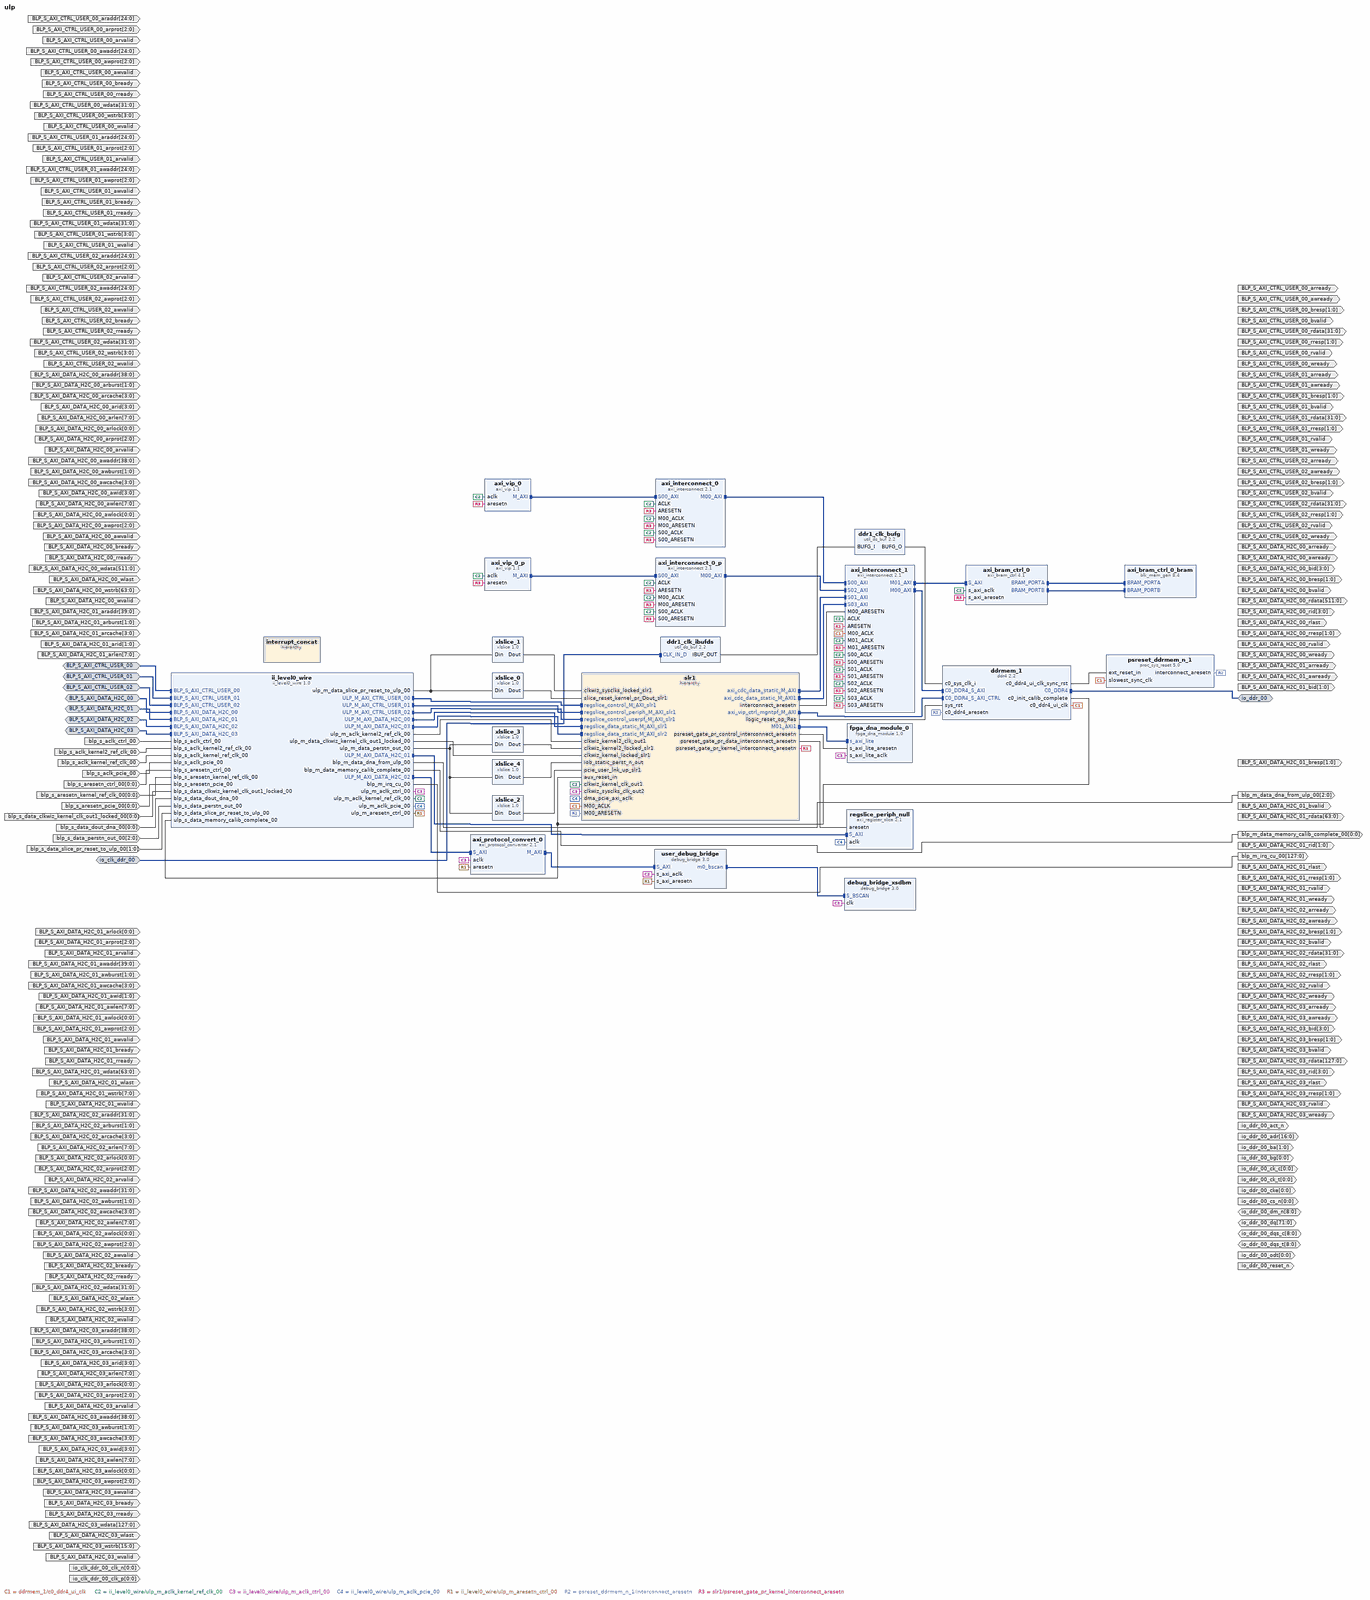
[diagram p0: block diagram of the top level, whole]
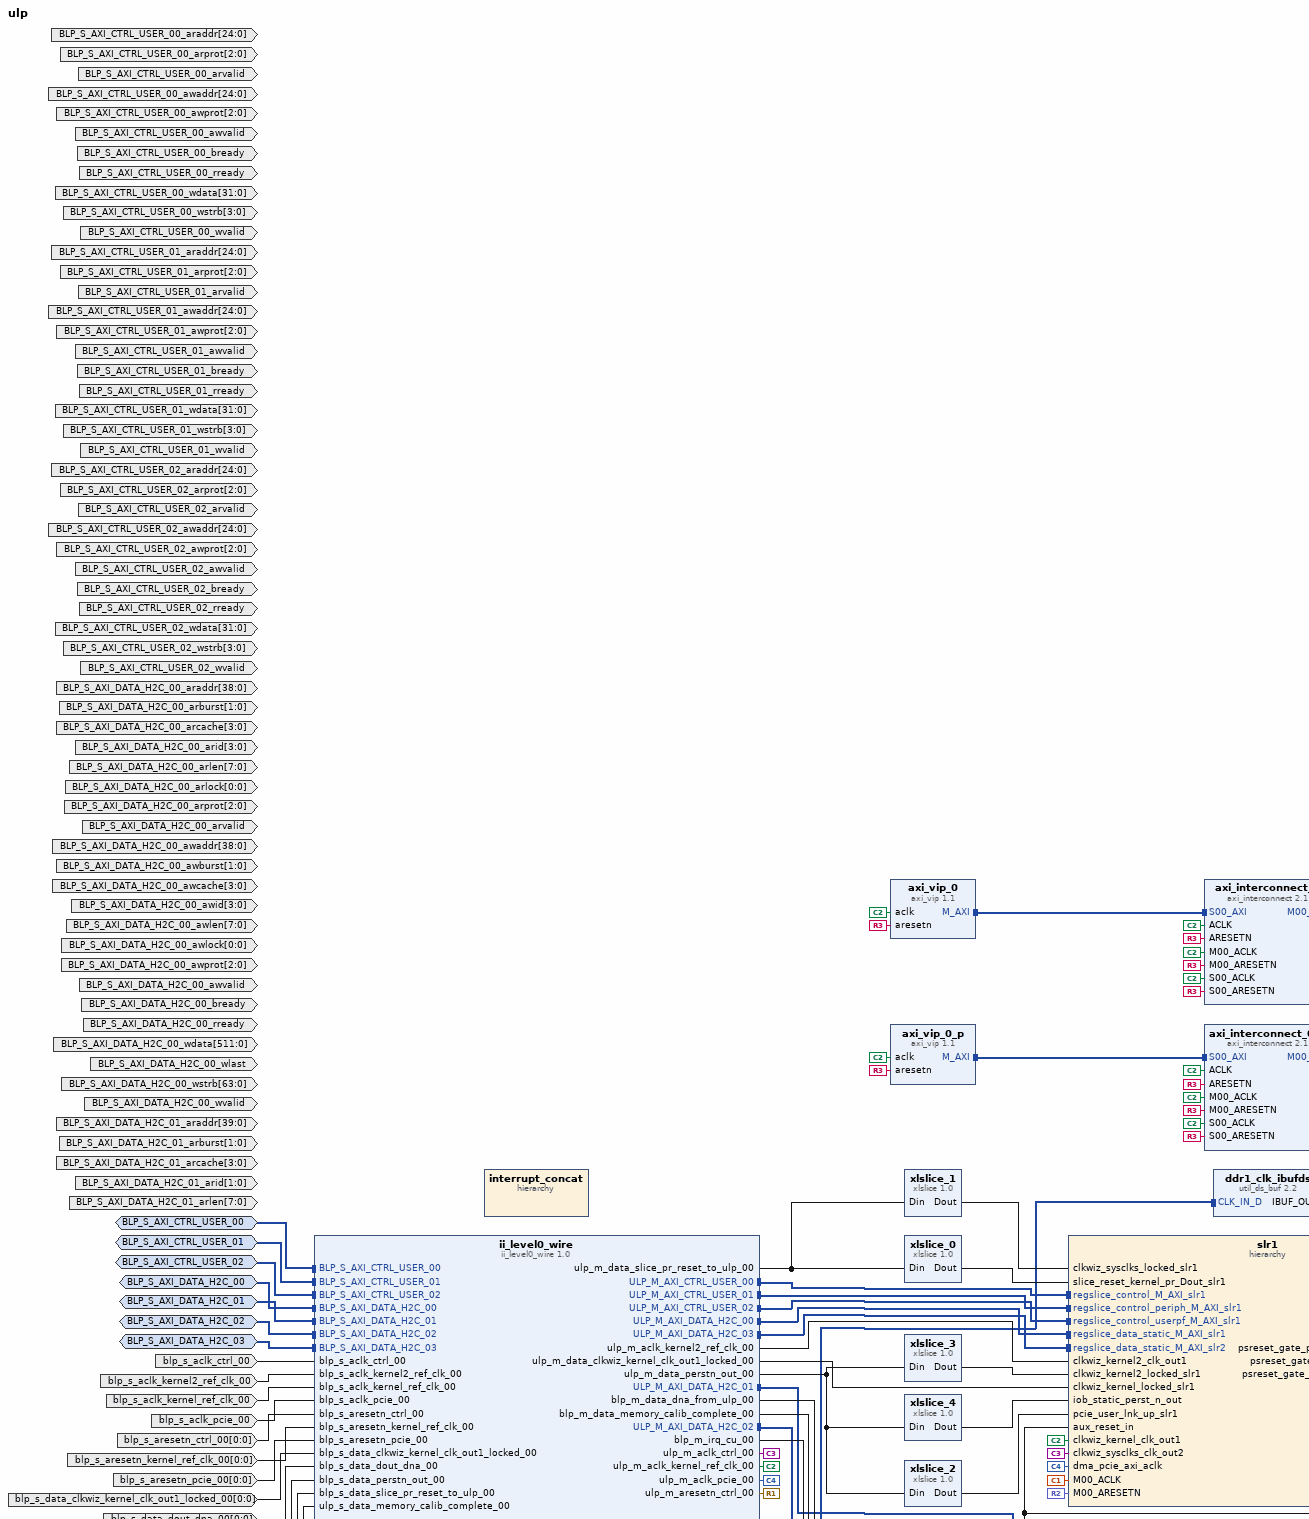
[diagram p1: block diagram of the top level, upper left part]
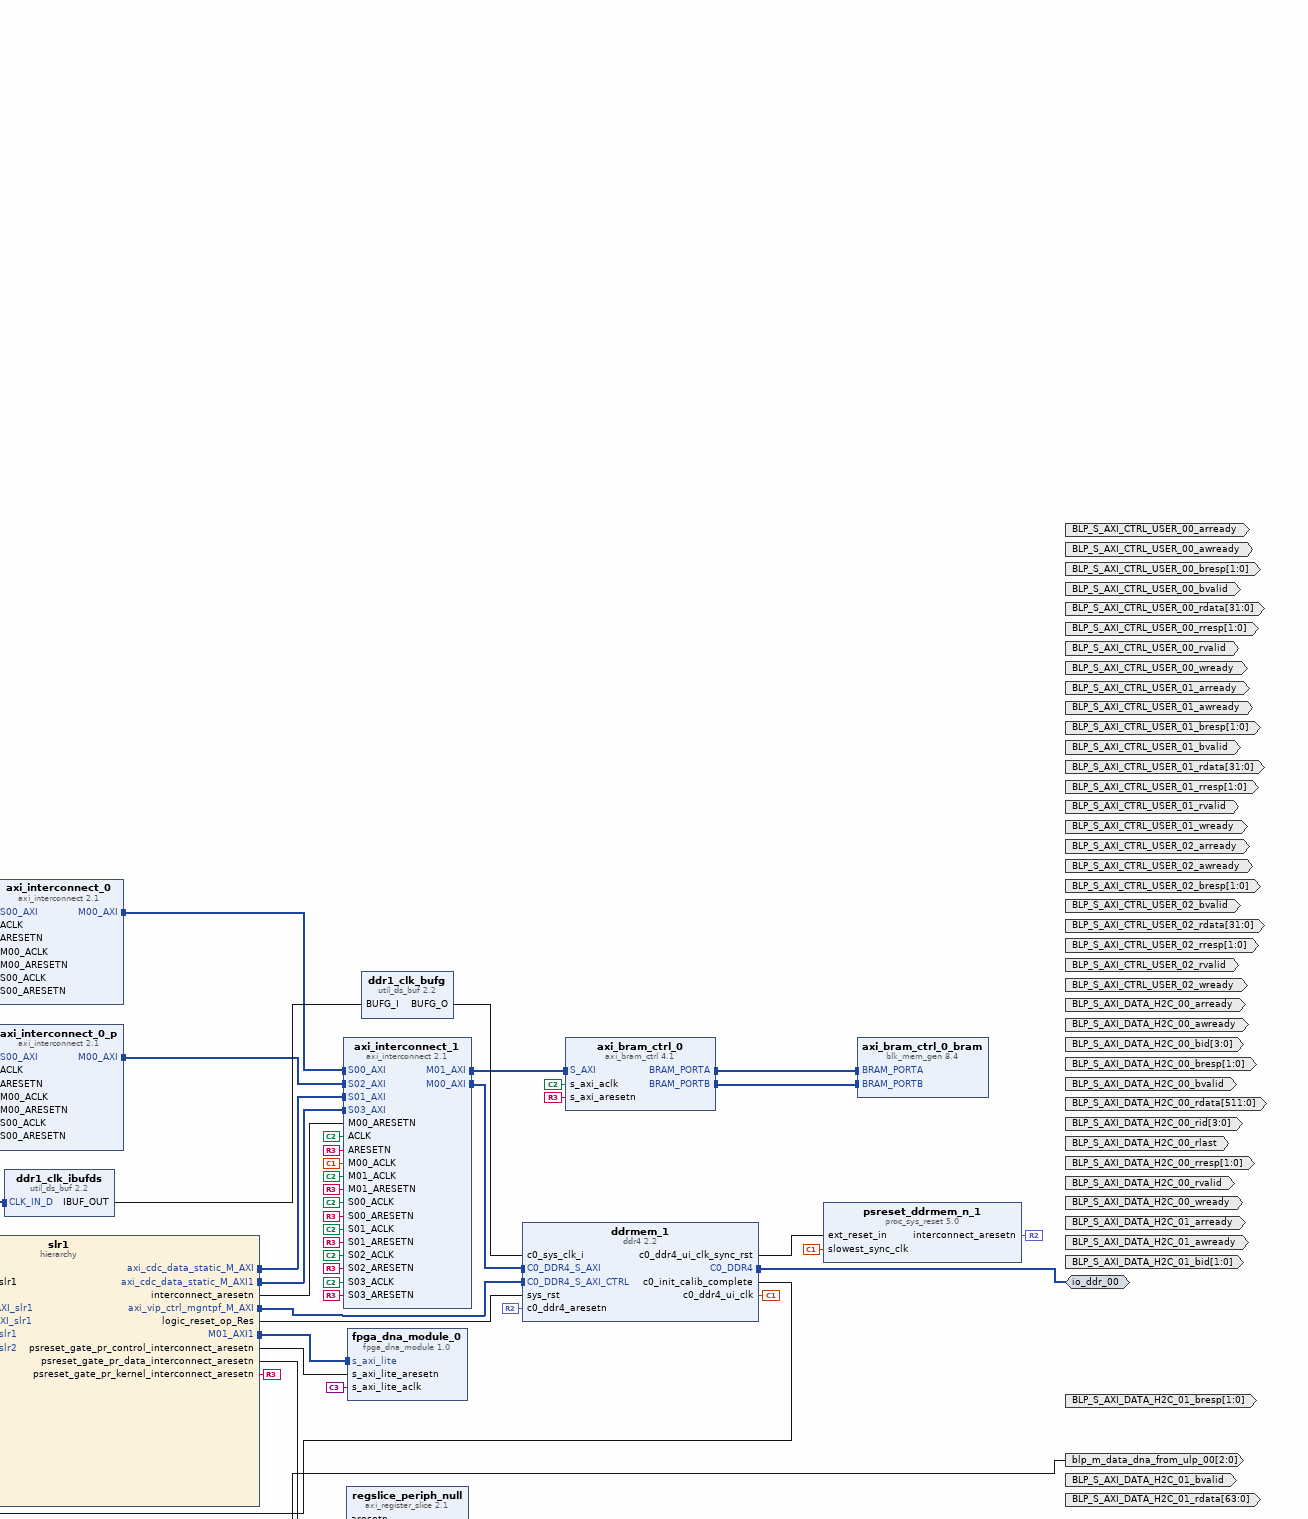
[diagram p2: block diagram of the top level, upper right part]
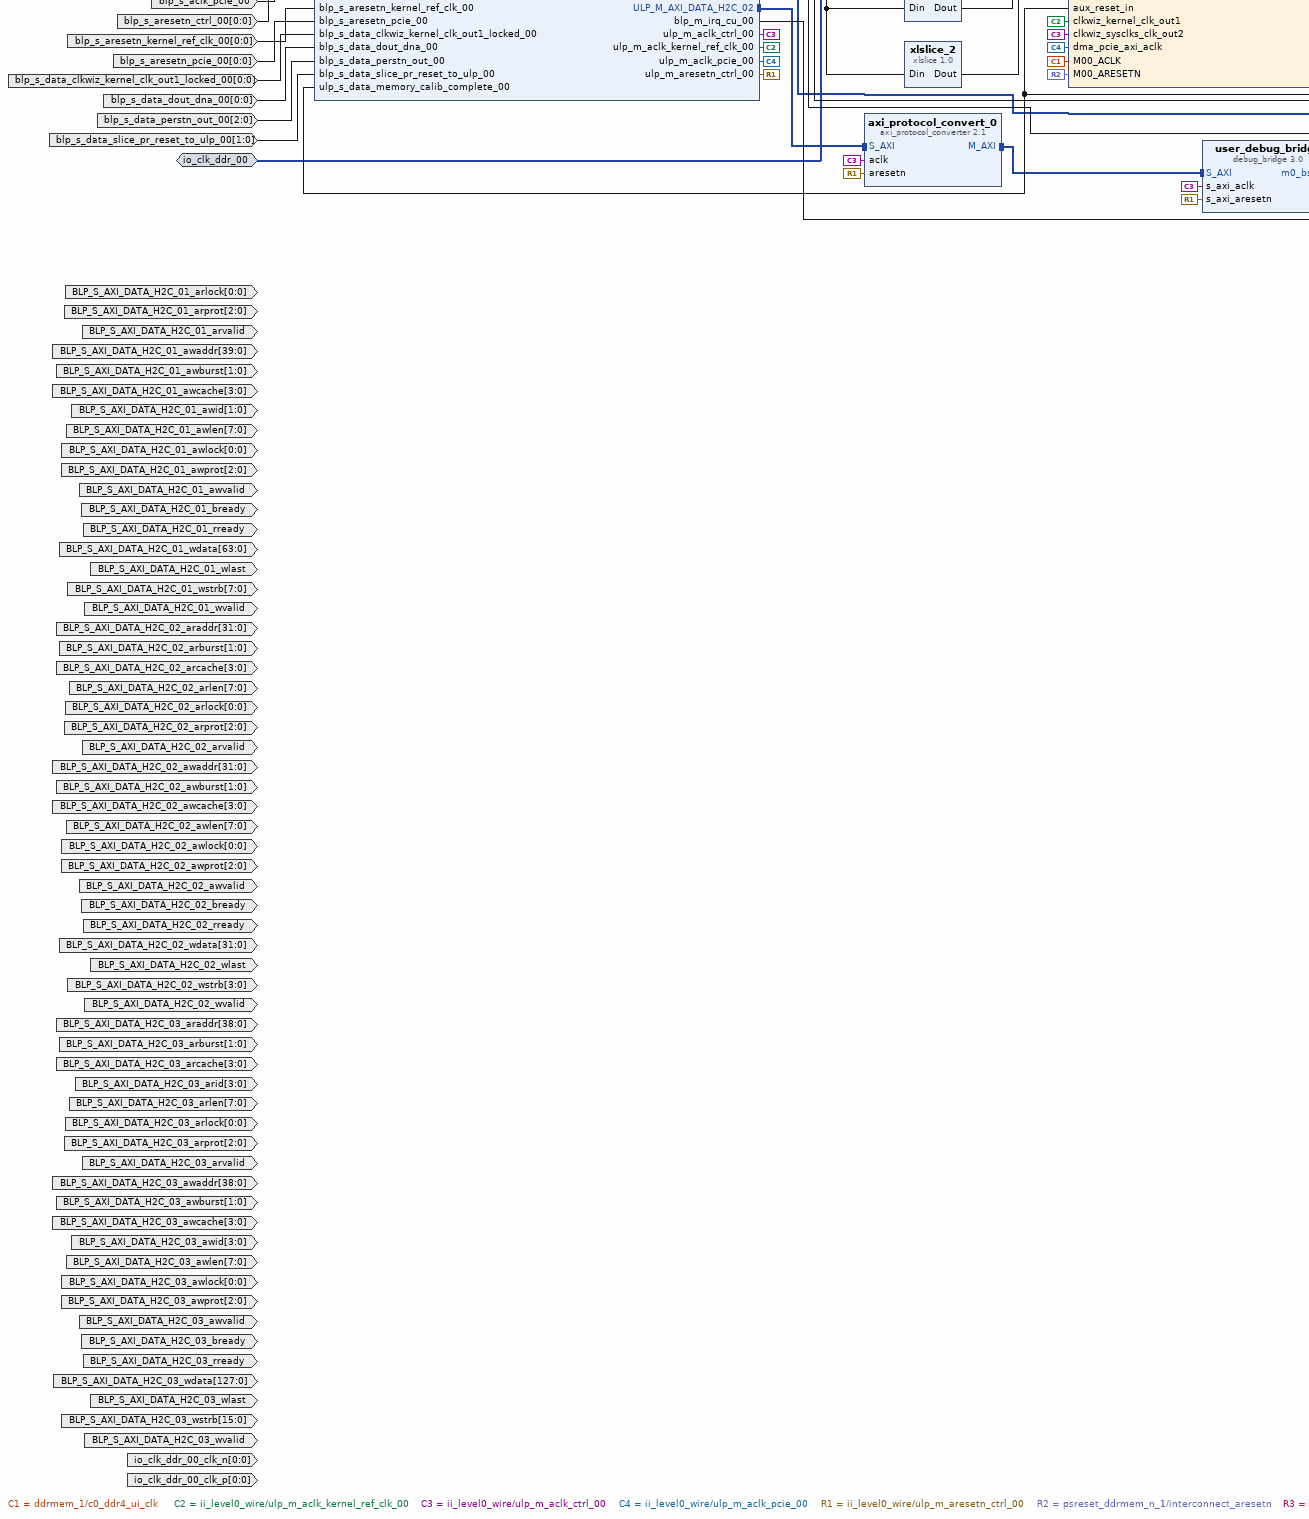
[diagram p3: block diagram of the top level, lower left part]
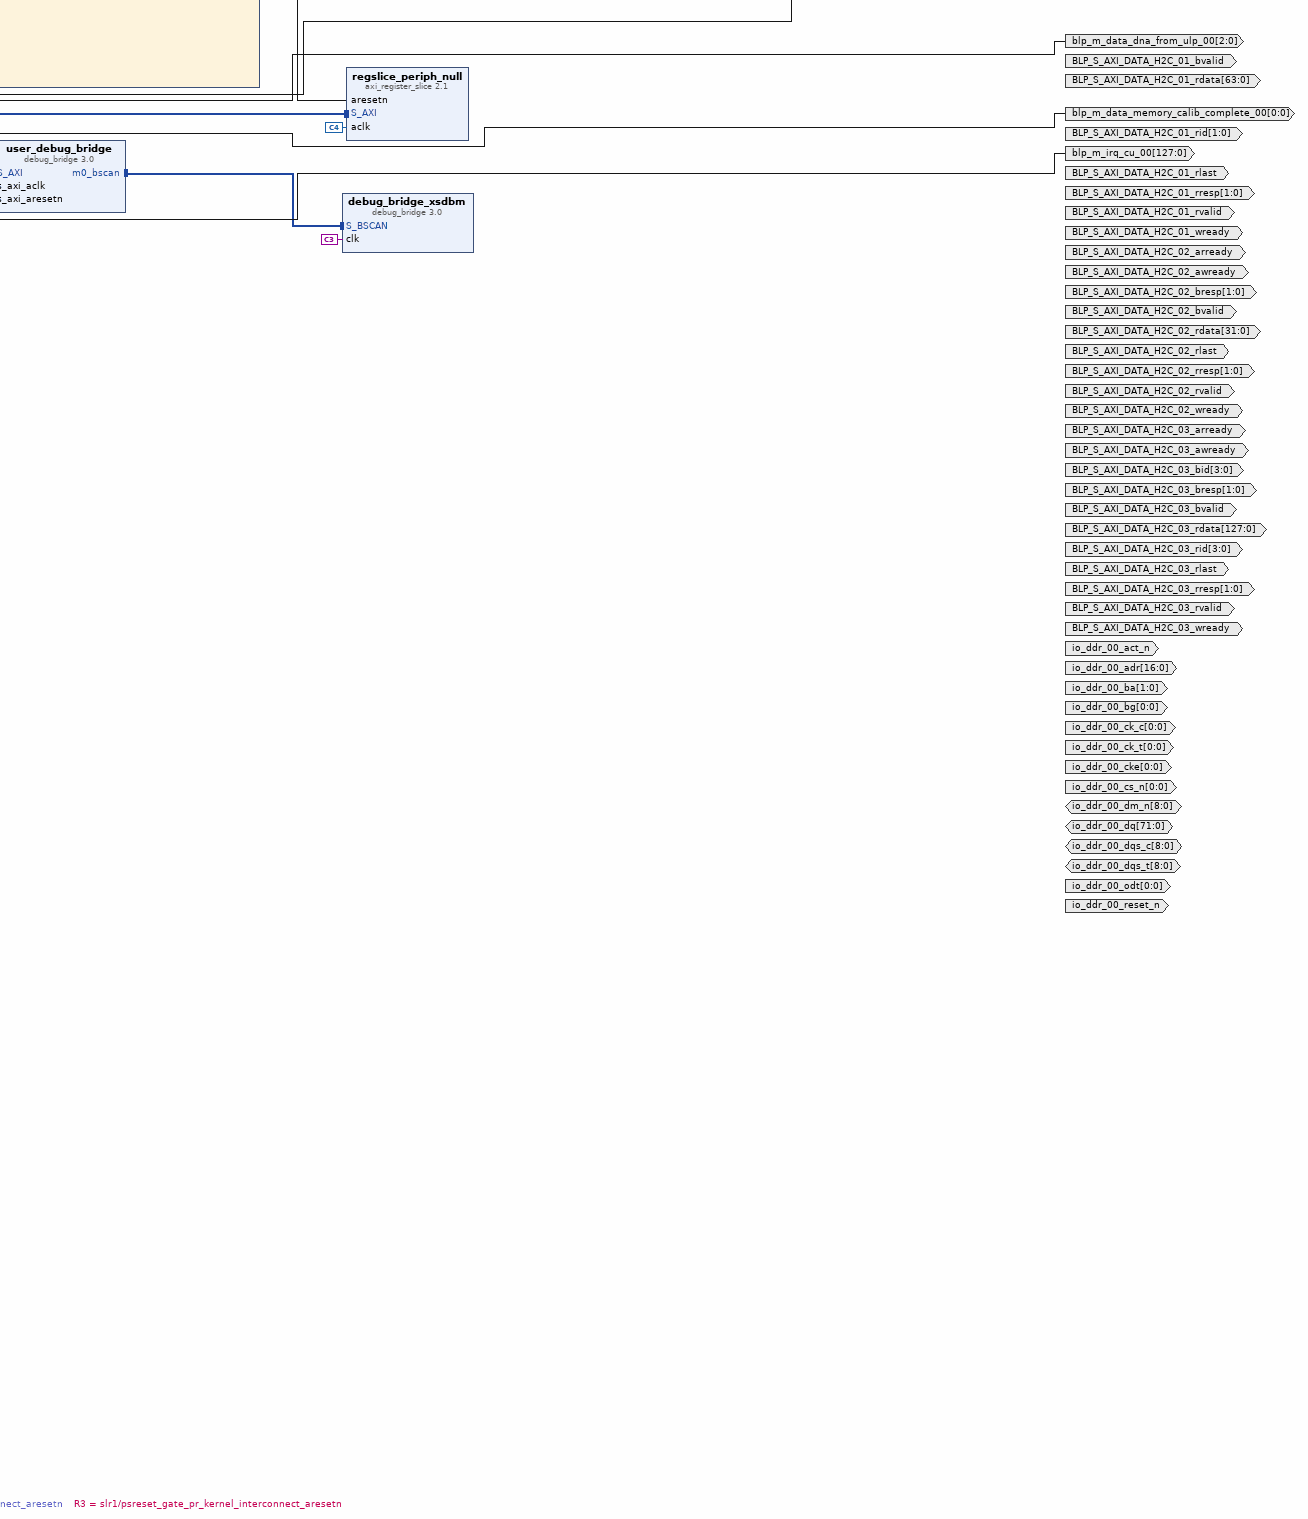
[diagram p4: block diagram of the top level, lower right part]
# Vivado block design ulp, xcku15p-ffva1156-2LV-e, Vivado 2021.1
create_bd_design ulp

create_bd_intf_port -mode Slave -vlnv xilinx.com:interface:aximm_rtl:1.0 BLP_S_AXI_CTRL_USER_00
set_property -dict [list \
  CONFIG.ADDR_WIDTH 25 \
  CONFIG.ARUSER_WIDTH 0 \
  CONFIG.AWUSER_WIDTH 0 \
  CONFIG.BUSER_WIDTH 0 \
  CONFIG.CLK_DOMAIN cd_ctrl_00 \
  CONFIG.DATA_WIDTH 32 \
  CONFIG.FREQ_HZ 50000000 \
  CONFIG.HAS_BRESP 1 \
  CONFIG.HAS_BURST 0 \
  CONFIG.HAS_CACHE 0 \
  CONFIG.HAS_LOCK 0 \
  CONFIG.HAS_PROT 1 \
  CONFIG.HAS_QOS 0 \
  CONFIG.HAS_REGION 0 \
  CONFIG.HAS_RRESP 1 \
  CONFIG.HAS_WSTRB 1 \
  CONFIG.ID_WIDTH 0 \
  CONFIG.MAX_BURST_LENGTH 1 \
  CONFIG.NUM_READ_OUTSTANDING 2 \
  CONFIG.NUM_READ_THREADS 1 \
  CONFIG.NUM_WRITE_OUTSTANDING 2 \
  CONFIG.NUM_WRITE_THREADS 1 \
  CONFIG.PHASE 0 \
  CONFIG.PROTOCOL AXI4LITE \
  CONFIG.READ_WRITE_MODE READ_WRITE \
  CONFIG.RUSER_BITS_PER_BYTE 0 \
  CONFIG.RUSER_WIDTH 0 \
  CONFIG.SUPPORTS_NARROW_BURST 0 \
  CONFIG.WUSER_BITS_PER_BYTE 0 \
  CONFIG.WUSER_WIDTH 0 \
] [get_bd_intf_ports BLP_S_AXI_CTRL_USER_00]
create_bd_intf_port -mode Slave -vlnv xilinx.com:interface:aximm_rtl:1.0 BLP_S_AXI_CTRL_USER_01
set_property -dict [list \
  CONFIG.ADDR_WIDTH 25 \
  CONFIG.ARUSER_WIDTH 0 \
  CONFIG.AWUSER_WIDTH 0 \
  CONFIG.BUSER_WIDTH 0 \
  CONFIG.CLK_DOMAIN cd_ctrl_00 \
  CONFIG.DATA_WIDTH 32 \
  CONFIG.FREQ_HZ 50000000 \
  CONFIG.HAS_BRESP 1 \
  CONFIG.HAS_BURST 0 \
  CONFIG.HAS_CACHE 0 \
  CONFIG.HAS_LOCK 0 \
  CONFIG.HAS_PROT 1 \
  CONFIG.HAS_QOS 0 \
  CONFIG.HAS_REGION 0 \
  CONFIG.HAS_RRESP 1 \
  CONFIG.HAS_WSTRB 1 \
  CONFIG.ID_WIDTH 0 \
  CONFIG.MAX_BURST_LENGTH 1 \
  CONFIG.NUM_READ_OUTSTANDING 2 \
  CONFIG.NUM_READ_THREADS 1 \
  CONFIG.NUM_WRITE_OUTSTANDING 2 \
  CONFIG.NUM_WRITE_THREADS 1 \
  CONFIG.PHASE 0 \
  CONFIG.PROTOCOL AXI4LITE \
  CONFIG.READ_WRITE_MODE READ_WRITE \
  CONFIG.RUSER_BITS_PER_BYTE 0 \
  CONFIG.RUSER_WIDTH 0 \
  CONFIG.SUPPORTS_NARROW_BURST 0 \
  CONFIG.WUSER_BITS_PER_BYTE 0 \
  CONFIG.WUSER_WIDTH 0 \
] [get_bd_intf_ports BLP_S_AXI_CTRL_USER_01]
create_bd_intf_port -mode Slave -vlnv xilinx.com:interface:aximm_rtl:1.0 BLP_S_AXI_CTRL_USER_02
set_property -dict [list \
  CONFIG.ADDR_WIDTH 25 \
  CONFIG.ARUSER_WIDTH 0 \
  CONFIG.AWUSER_WIDTH 0 \
  CONFIG.BUSER_WIDTH 0 \
  CONFIG.CLK_DOMAIN cd_pcie_00 \
  CONFIG.DATA_WIDTH 32 \
  CONFIG.FREQ_HZ 250000000 \
  CONFIG.HAS_BRESP 1 \
  CONFIG.HAS_BURST 0 \
  CONFIG.HAS_CACHE 0 \
  CONFIG.HAS_LOCK 0 \
  CONFIG.HAS_PROT 1 \
  CONFIG.HAS_QOS 0 \
  CONFIG.HAS_REGION 0 \
  CONFIG.HAS_RRESP 1 \
  CONFIG.HAS_WSTRB 1 \
  CONFIG.ID_WIDTH 0 \
  CONFIG.MAX_BURST_LENGTH 1 \
  CONFIG.NUM_READ_OUTSTANDING 2 \
  CONFIG.NUM_READ_THREADS 1 \
  CONFIG.NUM_WRITE_OUTSTANDING 2 \
  CONFIG.NUM_WRITE_THREADS 1 \
  CONFIG.PHASE 0 \
  CONFIG.PROTOCOL AXI4LITE \
  CONFIG.READ_WRITE_MODE READ_WRITE \
  CONFIG.RUSER_BITS_PER_BYTE 0 \
  CONFIG.RUSER_WIDTH 0 \
  CONFIG.SUPPORTS_NARROW_BURST 0 \
  CONFIG.WUSER_BITS_PER_BYTE 0 \
  CONFIG.WUSER_WIDTH 0 \
] [get_bd_intf_ports BLP_S_AXI_CTRL_USER_02]
create_bd_intf_port -mode Slave -vlnv xilinx.com:interface:aximm_rtl:1.0 BLP_S_AXI_DATA_H2C_00
set_property -dict [list \
  CONFIG.ADDR_WIDTH 39 \
  CONFIG.ARUSER_WIDTH 0 \
  CONFIG.AWUSER_WIDTH 0 \
  CONFIG.BUSER_WIDTH 0 \
  CONFIG.CLK_DOMAIN cd_pcie_00 \
  CONFIG.DATA_WIDTH 512 \
  CONFIG.FREQ_HZ 250000000 \
  CONFIG.HAS_BRESP 1 \
  CONFIG.HAS_BURST 1 \
  CONFIG.HAS_CACHE 1 \
  CONFIG.HAS_LOCK 1 \
  CONFIG.HAS_PROT 1 \
  CONFIG.HAS_QOS 0 \
  CONFIG.HAS_REGION 0 \
  CONFIG.HAS_RRESP 1 \
  CONFIG.HAS_WSTRB 1 \
  CONFIG.ID_WIDTH 4 \
  CONFIG.MAX_BURST_LENGTH 256 \
  CONFIG.NUM_READ_OUTSTANDING 16 \
  CONFIG.NUM_READ_THREADS 2 \
  CONFIG.NUM_WRITE_OUTSTANDING 16 \
  CONFIG.NUM_WRITE_THREADS 2 \
  CONFIG.PHASE 0 \
  CONFIG.PROTOCOL AXI4 \
  CONFIG.READ_WRITE_MODE READ_WRITE \
  CONFIG.RUSER_BITS_PER_BYTE 0 \
  CONFIG.RUSER_WIDTH 0 \
  CONFIG.SUPPORTS_NARROW_BURST 0 \
  CONFIG.WUSER_BITS_PER_BYTE 0 \
  CONFIG.WUSER_WIDTH 0 \
] [get_bd_intf_ports BLP_S_AXI_DATA_H2C_00]
create_bd_intf_port -mode Slave -vlnv xilinx.com:interface:aximm_rtl:1.0 BLP_S_AXI_DATA_H2C_01
set_property -dict [list \
  CONFIG.ADDR_WIDTH 40 \
  CONFIG.ARUSER_WIDTH 0 \
  CONFIG.AWUSER_WIDTH 0 \
  CONFIG.BUSER_WIDTH 0 \
  CONFIG.CLK_DOMAIN cd_pcie_00 \
  CONFIG.DATA_WIDTH 64 \
  CONFIG.FREQ_HZ 250000000 \
  CONFIG.HAS_BRESP 1 \
  CONFIG.HAS_BURST 1 \
  CONFIG.HAS_CACHE 1 \
  CONFIG.HAS_LOCK 1 \
  CONFIG.HAS_PROT 1 \
  CONFIG.HAS_QOS 0 \
  CONFIG.HAS_REGION 0 \
  CONFIG.HAS_RRESP 1 \
  CONFIG.HAS_WSTRB 1 \
  CONFIG.ID_WIDTH 2 \
  CONFIG.MAX_BURST_LENGTH 256 \
  CONFIG.NUM_READ_OUTSTANDING 16 \
  CONFIG.NUM_READ_THREADS 2 \
  CONFIG.NUM_WRITE_OUTSTANDING 16 \
  CONFIG.NUM_WRITE_THREADS 2 \
  CONFIG.PHASE 0 \
  CONFIG.PROTOCOL AXI4 \
  CONFIG.READ_WRITE_MODE READ_WRITE \
  CONFIG.RUSER_BITS_PER_BYTE 0 \
  CONFIG.RUSER_WIDTH 0 \
  CONFIG.SUPPORTS_NARROW_BURST 0 \
  CONFIG.WUSER_BITS_PER_BYTE 0 \
  CONFIG.WUSER_WIDTH 0 \
] [get_bd_intf_ports BLP_S_AXI_DATA_H2C_01]
create_bd_intf_port -mode Slave -vlnv xilinx.com:interface:aximm_rtl:1.0 BLP_S_AXI_DATA_H2C_02
set_property -dict [list \
  CONFIG.ADDR_WIDTH 32 \
  CONFIG.ARUSER_WIDTH 0 \
  CONFIG.AWUSER_WIDTH 0 \
  CONFIG.BUSER_WIDTH 0 \
  CONFIG.CLK_DOMAIN cd_ctrl_00 \
  CONFIG.DATA_WIDTH 32 \
  CONFIG.FREQ_HZ 50000000 \
  CONFIG.HAS_BRESP 1 \
  CONFIG.HAS_BURST 1 \
  CONFIG.HAS_CACHE 1 \
  CONFIG.HAS_LOCK 1 \
  CONFIG.HAS_PROT 1 \
  CONFIG.HAS_QOS 0 \
  CONFIG.HAS_REGION 0 \
  CONFIG.HAS_RRESP 1 \
  CONFIG.HAS_WSTRB 1 \
  CONFIG.ID_WIDTH 0 \
  CONFIG.MAX_BURST_LENGTH 256 \
  CONFIG.NUM_READ_OUTSTANDING 16 \
  CONFIG.NUM_READ_THREADS 2 \
  CONFIG.NUM_WRITE_OUTSTANDING 16 \
  CONFIG.NUM_WRITE_THREADS 2 \
  CONFIG.PHASE 0 \
  CONFIG.PROTOCOL AXI4 \
  CONFIG.READ_WRITE_MODE READ_WRITE \
  CONFIG.RUSER_BITS_PER_BYTE 0 \
  CONFIG.RUSER_WIDTH 0 \
  CONFIG.SUPPORTS_NARROW_BURST 0 \
  CONFIG.WUSER_BITS_PER_BYTE 0 \
  CONFIG.WUSER_WIDTH 0 \
] [get_bd_intf_ports BLP_S_AXI_DATA_H2C_02]
create_bd_intf_port -mode Slave -vlnv xilinx.com:interface:aximm_rtl:1.0 BLP_S_AXI_DATA_H2C_03
set_property -dict [list \
  CONFIG.ADDR_WIDTH 39 \
  CONFIG.ARUSER_WIDTH 0 \
  CONFIG.AWUSER_WIDTH 0 \
  CONFIG.BUSER_WIDTH 0 \
  CONFIG.CLK_DOMAIN cd_pcie_00 \
  CONFIG.DATA_WIDTH 128 \
  CONFIG.FREQ_HZ 250000000 \
  CONFIG.HAS_BRESP 1 \
  CONFIG.HAS_BURST 1 \
  CONFIG.HAS_CACHE 1 \
  CONFIG.HAS_LOCK 1 \
  CONFIG.HAS_PROT 1 \
  CONFIG.HAS_QOS 0 \
  CONFIG.HAS_REGION 0 \
  CONFIG.HAS_RRESP 1 \
  CONFIG.HAS_WSTRB 1 \
  CONFIG.ID_WIDTH 4 \
  CONFIG.MAX_BURST_LENGTH 256 \
  CONFIG.NUM_READ_OUTSTANDING 16 \
  CONFIG.NUM_READ_THREADS 2 \
  CONFIG.NUM_WRITE_OUTSTANDING 16 \
  CONFIG.NUM_WRITE_THREADS 2 \
  CONFIG.PHASE 0 \
  CONFIG.PROTOCOL AXI4 \
  CONFIG.READ_WRITE_MODE READ_WRITE \
  CONFIG.RUSER_BITS_PER_BYTE 0 \
  CONFIG.RUSER_WIDTH 0 \
  CONFIG.SUPPORTS_NARROW_BURST 0 \
  CONFIG.WUSER_BITS_PER_BYTE 0 \
  CONFIG.WUSER_WIDTH 0 \
] [get_bd_intf_ports BLP_S_AXI_DATA_H2C_03]
create_bd_intf_port -mode Slave -vlnv xilinx.com:interface:diff_clock_rtl:1.0 io_clk_ddr_00
create_bd_intf_port -mode Master -vlnv xilinx.com:interface:ddr4_rtl:1.0 io_ddr_00
create_bd_port -dir O -from 2 -to 0 -type data blp_m_data_dna_from_ulp_00
create_bd_port -dir O -from 0 -to 0 -type data blp_m_data_memory_calib_complete_00
create_bd_port -dir O -from 127 -to 0 -type intr blp_m_irq_cu_00
create_bd_port -dir I -type clk blp_s_aclk_ctrl_00
set_property -dict {CONFIG.CLK_DOMAIN cd_ctrl_00 CONFIG.FREQ_HZ 50000000 CONFIG.PHASE 0} [get_bd_ports blp_s_aclk_ctrl_00]
create_bd_port -dir I -type clk blp_s_aclk_kernel2_ref_clk_00
set_property -dict [list \
  CONFIG.CLK_DOMAIN cd_kernel2_ref_clk_00 \
  CONFIG.FREQ_HZ 500000000 \
  CONFIG.PHASE 0 \
] [get_bd_ports blp_s_aclk_kernel2_ref_clk_00]
create_bd_port -dir I -type clk blp_s_aclk_kernel_ref_clk_00
set_property -dict [list \
  CONFIG.CLK_DOMAIN cd_kernel_ref_clk_00 \
  CONFIG.FREQ_HZ 300000000 \
  CONFIG.PHASE 0 \
] [get_bd_ports blp_s_aclk_kernel_ref_clk_00]
create_bd_port -dir I -type clk blp_s_aclk_pcie_00
set_property -dict {CONFIG.CLK_DOMAIN cd_pcie_00 CONFIG.FREQ_HZ 250000000 CONFIG.PHASE 0} [get_bd_ports blp_s_aclk_pcie_00]
create_bd_port -dir I -from 0 -to 0 -type rst blp_s_aresetn_ctrl_00
create_bd_port -dir I -from 0 -to 0 -type rst blp_s_aresetn_kernel_ref_clk_00
create_bd_port -dir I -from 0 -to 0 -type rst blp_s_aresetn_pcie_00
create_bd_port -dir I -from 0 -to 0 -type data blp_s_data_clkwiz_kernel_clk_out1_locked_00
create_bd_port -dir I -from 0 -to 0 -type data blp_s_data_dout_dna_00
create_bd_port -dir I -from 2 -to 0 -type data blp_s_data_perstn_out_00
create_bd_port -dir I -from 1 -to 0 -type data blp_s_data_slice_pr_reset_to_ulp_00
create_bd_port -dir I -from 24 -to 0 BLP_S_AXI_CTRL_USER_00_araddr
create_bd_port -dir I -from 2 -to 0 BLP_S_AXI_CTRL_USER_00_arprot
create_bd_port -dir O BLP_S_AXI_CTRL_USER_00_arready
create_bd_port -dir I BLP_S_AXI_CTRL_USER_00_arvalid
create_bd_port -dir I -from 24 -to 0 BLP_S_AXI_CTRL_USER_00_awaddr
create_bd_port -dir I -from 2 -to 0 BLP_S_AXI_CTRL_USER_00_awprot
create_bd_port -dir O BLP_S_AXI_CTRL_USER_00_awready
create_bd_port -dir I BLP_S_AXI_CTRL_USER_00_awvalid
create_bd_port -dir I BLP_S_AXI_CTRL_USER_00_bready
create_bd_port -dir O -from 1 -to 0 BLP_S_AXI_CTRL_USER_00_bresp
create_bd_port -dir O BLP_S_AXI_CTRL_USER_00_bvalid
create_bd_port -dir O -from 31 -to 0 BLP_S_AXI_CTRL_USER_00_rdata
create_bd_port -dir I BLP_S_AXI_CTRL_USER_00_rready
create_bd_port -dir O -from 1 -to 0 BLP_S_AXI_CTRL_USER_00_rresp
create_bd_port -dir O BLP_S_AXI_CTRL_USER_00_rvalid
create_bd_port -dir I -from 31 -to 0 BLP_S_AXI_CTRL_USER_00_wdata
create_bd_port -dir O BLP_S_AXI_CTRL_USER_00_wready
create_bd_port -dir I -from 3 -to 0 BLP_S_AXI_CTRL_USER_00_wstrb
create_bd_port -dir I BLP_S_AXI_CTRL_USER_00_wvalid
create_bd_port -dir I -from 24 -to 0 BLP_S_AXI_CTRL_USER_01_araddr
create_bd_port -dir I -from 2 -to 0 BLP_S_AXI_CTRL_USER_01_arprot
create_bd_port -dir O BLP_S_AXI_CTRL_USER_01_arready
create_bd_port -dir I BLP_S_AXI_CTRL_USER_01_arvalid
create_bd_port -dir I -from 24 -to 0 BLP_S_AXI_CTRL_USER_01_awaddr
create_bd_port -dir I -from 2 -to 0 BLP_S_AXI_CTRL_USER_01_awprot
create_bd_port -dir O BLP_S_AXI_CTRL_USER_01_awready
create_bd_port -dir I BLP_S_AXI_CTRL_USER_01_awvalid
create_bd_port -dir I BLP_S_AXI_CTRL_USER_01_bready
create_bd_port -dir O -from 1 -to 0 BLP_S_AXI_CTRL_USER_01_bresp
create_bd_port -dir O BLP_S_AXI_CTRL_USER_01_bvalid
create_bd_port -dir O -from 31 -to 0 BLP_S_AXI_CTRL_USER_01_rdata
create_bd_port -dir I BLP_S_AXI_CTRL_USER_01_rready
create_bd_port -dir O -from 1 -to 0 BLP_S_AXI_CTRL_USER_01_rresp
create_bd_port -dir O BLP_S_AXI_CTRL_USER_01_rvalid
create_bd_port -dir I -from 31 -to 0 BLP_S_AXI_CTRL_USER_01_wdata
create_bd_port -dir O BLP_S_AXI_CTRL_USER_01_wready
create_bd_port -dir I -from 3 -to 0 BLP_S_AXI_CTRL_USER_01_wstrb
create_bd_port -dir I BLP_S_AXI_CTRL_USER_01_wvalid
create_bd_port -dir I -from 24 -to 0 BLP_S_AXI_CTRL_USER_02_araddr
create_bd_port -dir I -from 2 -to 0 BLP_S_AXI_CTRL_USER_02_arprot
create_bd_port -dir O BLP_S_AXI_CTRL_USER_02_arready
create_bd_port -dir I BLP_S_AXI_CTRL_USER_02_arvalid
create_bd_port -dir I -from 24 -to 0 BLP_S_AXI_CTRL_USER_02_awaddr
create_bd_port -dir I -from 2 -to 0 BLP_S_AXI_CTRL_USER_02_awprot
create_bd_port -dir O BLP_S_AXI_CTRL_USER_02_awready
create_bd_port -dir I BLP_S_AXI_CTRL_USER_02_awvalid
create_bd_port -dir I BLP_S_AXI_CTRL_USER_02_bready
create_bd_port -dir O -from 1 -to 0 BLP_S_AXI_CTRL_USER_02_bresp
create_bd_port -dir O BLP_S_AXI_CTRL_USER_02_bvalid
create_bd_port -dir O -from 31 -to 0 BLP_S_AXI_CTRL_USER_02_rdata
create_bd_port -dir I BLP_S_AXI_CTRL_USER_02_rready
create_bd_port -dir O -from 1 -to 0 BLP_S_AXI_CTRL_USER_02_rresp
create_bd_port -dir O BLP_S_AXI_CTRL_USER_02_rvalid
create_bd_port -dir I -from 31 -to 0 BLP_S_AXI_CTRL_USER_02_wdata
create_bd_port -dir O BLP_S_AXI_CTRL_USER_02_wready
create_bd_port -dir I -from 3 -to 0 BLP_S_AXI_CTRL_USER_02_wstrb
create_bd_port -dir I BLP_S_AXI_CTRL_USER_02_wvalid
create_bd_port -dir I -from 38 -to 0 BLP_S_AXI_DATA_H2C_00_araddr
create_bd_port -dir I -from 1 -to 0 BLP_S_AXI_DATA_H2C_00_arburst
create_bd_port -dir I -from 3 -to 0 BLP_S_AXI_DATA_H2C_00_arcache
create_bd_port -dir I -from 7 -to 0 BLP_S_AXI_DATA_H2C_00_arlen
create_bd_port -dir I -from 0 -to 0 BLP_S_AXI_DATA_H2C_00_arlock
create_bd_port -dir I -from 2 -to 0 BLP_S_AXI_DATA_H2C_00_arprot
create_bd_port -dir O BLP_S_AXI_DATA_H2C_00_arready
create_bd_port -dir I BLP_S_AXI_DATA_H2C_00_arvalid
create_bd_port -dir I -from 38 -to 0 BLP_S_AXI_DATA_H2C_00_awaddr
create_bd_port -dir I -from 1 -to 0 BLP_S_AXI_DATA_H2C_00_awburst
create_bd_port -dir I -from 3 -to 0 BLP_S_AXI_DATA_H2C_00_awcache
create_bd_port -dir I -from 7 -to 0 BLP_S_AXI_DATA_H2C_00_awlen
create_bd_port -dir I -from 0 -to 0 BLP_S_AXI_DATA_H2C_00_awlock
create_bd_port -dir I -from 2 -to 0 BLP_S_AXI_DATA_H2C_00_awprot
create_bd_port -dir O BLP_S_AXI_DATA_H2C_00_awready
create_bd_port -dir I BLP_S_AXI_DATA_H2C_00_awvalid
create_bd_port -dir I BLP_S_AXI_DATA_H2C_00_bready
create_bd_port -dir O -from 1 -to 0 BLP_S_AXI_DATA_H2C_00_bresp
create_bd_port -dir O BLP_S_AXI_DATA_H2C_00_bvalid
create_bd_port -dir O -from 511 -to 0 BLP_S_AXI_DATA_H2C_00_rdata
create_bd_port -dir O BLP_S_AXI_DATA_H2C_00_rlast
create_bd_port -dir I BLP_S_AXI_DATA_H2C_00_rready
create_bd_port -dir O -from 1 -to 0 BLP_S_AXI_DATA_H2C_00_rresp
create_bd_port -dir O BLP_S_AXI_DATA_H2C_00_rvalid
create_bd_port -dir I -from 511 -to 0 BLP_S_AXI_DATA_H2C_00_wdata
create_bd_port -dir I BLP_S_AXI_DATA_H2C_00_wlast
create_bd_port -dir O BLP_S_AXI_DATA_H2C_00_wready
create_bd_port -dir I -from 63 -to 0 BLP_S_AXI_DATA_H2C_00_wstrb
create_bd_port -dir I BLP_S_AXI_DATA_H2C_00_wvalid
create_bd_port -dir I -from 3 -to 0 BLP_S_AXI_DATA_H2C_00_arid
create_bd_port -dir I -from 3 -to 0 BLP_S_AXI_DATA_H2C_00_awid
create_bd_port -dir O -from 3 -to 0 BLP_S_AXI_DATA_H2C_00_bid
create_bd_port -dir O -from 3 -to 0 BLP_S_AXI_DATA_H2C_00_rid
create_bd_port -dir I -from 39 -to 0 BLP_S_AXI_DATA_H2C_01_araddr
create_bd_port -dir I -from 1 -to 0 BLP_S_AXI_DATA_H2C_01_arburst
create_bd_port -dir I -from 3 -to 0 BLP_S_AXI_DATA_H2C_01_arcache
create_bd_port -dir I -from 7 -to 0 BLP_S_AXI_DATA_H2C_01_arlen
create_bd_port -dir I -from 0 -to 0 BLP_S_AXI_DATA_H2C_01_arlock
create_bd_port -dir I -from 2 -to 0 BLP_S_AXI_DATA_H2C_01_arprot
create_bd_port -dir O BLP_S_AXI_DATA_H2C_01_arready
create_bd_port -dir I BLP_S_AXI_DATA_H2C_01_arvalid
create_bd_port -dir I -from 39 -to 0 BLP_S_AXI_DATA_H2C_01_awaddr
create_bd_port -dir I -from 1 -to 0 BLP_S_AXI_DATA_H2C_01_awburst
create_bd_port -dir I -from 3 -to 0 BLP_S_AXI_DATA_H2C_01_awcache
create_bd_port -dir I -from 7 -to 0 BLP_S_AXI_DATA_H2C_01_awlen
create_bd_port -dir I -from 0 -to 0 BLP_S_AXI_DATA_H2C_01_awlock
create_bd_port -dir I -from 2 -to 0 BLP_S_AXI_DATA_H2C_01_awprot
create_bd_port -dir O BLP_S_AXI_DATA_H2C_01_awready
create_bd_port -dir I BLP_S_AXI_DATA_H2C_01_awvalid
create_bd_port -dir I BLP_S_AXI_DATA_H2C_01_bready
create_bd_port -dir O -from 1 -to 0 BLP_S_AXI_DATA_H2C_01_bresp
create_bd_port -dir O BLP_S_AXI_DATA_H2C_01_bvalid
create_bd_port -dir O -from 63 -to 0 BLP_S_AXI_DATA_H2C_01_rdata
create_bd_port -dir O BLP_S_AXI_DATA_H2C_01_rlast
create_bd_port -dir I BLP_S_AXI_DATA_H2C_01_rready
create_bd_port -dir O -from 1 -to 0 BLP_S_AXI_DATA_H2C_01_rresp
create_bd_port -dir O BLP_S_AXI_DATA_H2C_01_rvalid
create_bd_port -dir I -from 63 -to 0 BLP_S_AXI_DATA_H2C_01_wdata
create_bd_port -dir I BLP_S_AXI_DATA_H2C_01_wlast
create_bd_port -dir O BLP_S_AXI_DATA_H2C_01_wready
create_bd_port -dir I -from 7 -to 0 BLP_S_AXI_DATA_H2C_01_wstrb
create_bd_port -dir I BLP_S_AXI_DATA_H2C_01_wvalid
create_bd_port -dir I -from 1 -to 0 BLP_S_AXI_DATA_H2C_01_arid
create_bd_port -dir I -from 1 -to 0 BLP_S_AXI_DATA_H2C_01_awid
create_bd_port -dir O -from 1 -to 0 BLP_S_AXI_DATA_H2C_01_bid
create_bd_port -dir O -from 1 -to 0 BLP_S_AXI_DATA_H2C_01_rid
create_bd_port -dir I -from 31 -to 0 BLP_S_AXI_DATA_H2C_02_araddr
create_bd_port -dir I -from 1 -to 0 BLP_S_AXI_DATA_H2C_02_arburst
create_bd_port -dir I -from 3 -to 0 BLP_S_AXI_DATA_H2C_02_arcache
create_bd_port -dir I -from 7 -to 0 BLP_S_AXI_DATA_H2C_02_arlen
create_bd_port -dir I -from 0 -to 0 BLP_S_AXI_DATA_H2C_02_arlock
create_bd_port -dir I -from 2 -to 0 BLP_S_AXI_DATA_H2C_02_arprot
create_bd_port -dir O BLP_S_AXI_DATA_H2C_02_arready
create_bd_port -dir I BLP_S_AXI_DATA_H2C_02_arvalid
create_bd_port -dir I -from 31 -to 0 BLP_S_AXI_DATA_H2C_02_awaddr
create_bd_port -dir I -from 1 -to 0 BLP_S_AXI_DATA_H2C_02_awburst
create_bd_port -dir I -from 3 -to 0 BLP_S_AXI_DATA_H2C_02_awcache
create_bd_port -dir I -from 7 -to 0 BLP_S_AXI_DATA_H2C_02_awlen
create_bd_port -dir I -from 0 -to 0 BLP_S_AXI_DATA_H2C_02_awlock
create_bd_port -dir I -from 2 -to 0 BLP_S_AXI_DATA_H2C_02_awprot
create_bd_port -dir O BLP_S_AXI_DATA_H2C_02_awready
create_bd_port -dir I BLP_S_AXI_DATA_H2C_02_awvalid
create_bd_port -dir I BLP_S_AXI_DATA_H2C_02_bready
create_bd_port -dir O -from 1 -to 0 BLP_S_AXI_DATA_H2C_02_bresp
create_bd_port -dir O BLP_S_AXI_DATA_H2C_02_bvalid
create_bd_port -dir O -from 31 -to 0 BLP_S_AXI_DATA_H2C_02_rdata
create_bd_port -dir O BLP_S_AXI_DATA_H2C_02_rlast
create_bd_port -dir I BLP_S_AXI_DATA_H2C_02_rready
create_bd_port -dir O -from 1 -to 0 BLP_S_AXI_DATA_H2C_02_rresp
create_bd_port -dir O BLP_S_AXI_DATA_H2C_02_rvalid
create_bd_port -dir I -from 31 -to 0 BLP_S_AXI_DATA_H2C_02_wdata
create_bd_port -dir I BLP_S_AXI_DATA_H2C_02_wlast
create_bd_port -dir O BLP_S_AXI_DATA_H2C_02_wready
create_bd_port -dir I -from 3 -to 0 BLP_S_AXI_DATA_H2C_02_wstrb
create_bd_port -dir I BLP_S_AXI_DATA_H2C_02_wvalid
create_bd_port -dir I -from 38 -to 0 BLP_S_AXI_DATA_H2C_03_araddr
create_bd_port -dir I -from 1 -to 0 BLP_S_AXI_DATA_H2C_03_arburst
create_bd_port -dir I -from 3 -to 0 BLP_S_AXI_DATA_H2C_03_arcache
create_bd_port -dir I -from 7 -to 0 BLP_S_AXI_DATA_H2C_03_arlen
create_bd_port -dir I -from 0 -to 0 BLP_S_AXI_DATA_H2C_03_arlock
create_bd_port -dir I -from 2 -to 0 BLP_S_AXI_DATA_H2C_03_arprot
create_bd_port -dir O BLP_S_AXI_DATA_H2C_03_arready
create_bd_port -dir I BLP_S_AXI_DATA_H2C_03_arvalid
create_bd_port -dir I -from 38 -to 0 BLP_S_AXI_DATA_H2C_03_awaddr
create_bd_port -dir I -from 1 -to 0 BLP_S_AXI_DATA_H2C_03_awburst
create_bd_port -dir I -from 3 -to 0 BLP_S_AXI_DATA_H2C_03_awcache
create_bd_port -dir I -from 7 -to 0 BLP_S_AXI_DATA_H2C_03_awlen
create_bd_port -dir I -from 0 -to 0 BLP_S_AXI_DATA_H2C_03_awlock
create_bd_port -dir I -from 2 -to 0 BLP_S_AXI_DATA_H2C_03_awprot
create_bd_port -dir O BLP_S_AXI_DATA_H2C_03_awready
create_bd_port -dir I BLP_S_AXI_DATA_H2C_03_awvalid
create_bd_port -dir I BLP_S_AXI_DATA_H2C_03_bready
create_bd_port -dir O -from 1 -to 0 BLP_S_AXI_DATA_H2C_03_bresp
create_bd_port -dir O BLP_S_AXI_DATA_H2C_03_bvalid
create_bd_port -dir O -from 127 -to 0 BLP_S_AXI_DATA_H2C_03_rdata
create_bd_port -dir O BLP_S_AXI_DATA_H2C_03_rlast
create_bd_port -dir I BLP_S_AXI_DATA_H2C_03_rready
create_bd_port -dir O -from 1 -to 0 BLP_S_AXI_DATA_H2C_03_rresp
create_bd_port -dir O BLP_S_AXI_DATA_H2C_03_rvalid
create_bd_port -dir I -from 127 -to 0 BLP_S_AXI_DATA_H2C_03_wdata
create_bd_port -dir I BLP_S_AXI_DATA_H2C_03_wlast
create_bd_port -dir O BLP_S_AXI_DATA_H2C_03_wready
create_bd_port -dir I -from 15 -to 0 BLP_S_AXI_DATA_H2C_03_wstrb
create_bd_port -dir I BLP_S_AXI_DATA_H2C_03_wvalid
create_bd_port -dir I -from 3 -to 0 BLP_S_AXI_DATA_H2C_03_arid
create_bd_port -dir I -from 3 -to 0 BLP_S_AXI_DATA_H2C_03_awid
create_bd_port -dir O -from 3 -to 0 BLP_S_AXI_DATA_H2C_03_bid
create_bd_port -dir O -from 3 -to 0 BLP_S_AXI_DATA_H2C_03_rid
create_bd_port -dir I -from 0 -to 0 -type clk io_clk_ddr_00_clk_p
create_bd_port -dir I -from 0 -to 0 -type clk io_clk_ddr_00_clk_n
create_bd_port -dir O io_ddr_00_act_n
create_bd_port -dir O -from 16 -to 0 io_ddr_00_adr
create_bd_port -dir O -from 1 -to 0 io_ddr_00_ba
create_bd_port -dir O -from 0 -to 0 io_ddr_00_bg
create_bd_port -dir O -from 0 -to 0 -type clk io_ddr_00_ck_c
create_bd_port -dir O -from 0 -to 0 -type clk io_ddr_00_ck_t
create_bd_port -dir O -from 0 -to 0 io_ddr_00_cke
create_bd_port -dir O -from 0 -to 0 io_ddr_00_cs_n
create_bd_port -dir IO -from 8 -to 0 io_ddr_00_dm_n
create_bd_port -dir IO -from 71 -to 0 io_ddr_00_dq
create_bd_port -dir IO -from 8 -to 0 io_ddr_00_dqs_c
create_bd_port -dir IO -from 8 -to 0 io_ddr_00_dqs_t
create_bd_port -dir O -from 0 -to 0 io_ddr_00_odt
create_bd_port -dir O io_ddr_00_reset_n

create_bd_cell -type ip -vlnv xilinx.com:ip:ii_level0_wire:1.0 ii_level0_wire
create_bd_cell -type ip -vlnv xilinx.com:ip:axi_bram_ctrl:4.1 axi_bram_ctrl_0
set_property -dict {CONFIG.DATA_WIDTH 512} [get_bd_cells axi_bram_ctrl_0]
create_bd_cell -type ip -vlnv xilinx.com:ip:blk_mem_gen:8.4 axi_bram_ctrl_0_bram
set_property -dict {CONFIG.Memory_Type True_Dual_Port_RAM CONFIG.PRIM_type_to_Implement URAM} [get_bd_cells axi_bram_ctrl_0_bram]
create_bd_cell -type ip -vlnv xilinx.com:ip:axi_interconnect:2.1 axi_interconnect_0
set_property -dict {CONFIG.NUM_MI 1 CONFIG.S00_HAS_REGSLICE 4} [get_bd_cells axi_interconnect_0]
create_bd_cell -type ip -vlnv xilinx.com:ip:axi_interconnect:2.1 axi_interconnect_0_p
set_property -dict {CONFIG.NUM_MI 1 CONFIG.S00_HAS_REGSLICE 4} [get_bd_cells axi_interconnect_0_p]
create_bd_cell -type ip -vlnv xilinx.com:ip:axi_interconnect:2.1 axi_interconnect_1
set_property -dict [list \
  CONFIG.NUM_MI 2 \
  CONFIG.NUM_SI 4 \
  CONFIG.S00_HAS_REGSLICE 4 \
  CONFIG.S01_HAS_REGSLICE 4 \
  CONFIG.S02_HAS_REGSLICE 4 \
  CONFIG.S03_HAS_REGSLICE 4 \
] [get_bd_cells axi_interconnect_1]
create_bd_cell -type ip -vlnv xilinx.com:ip:axi_vip:1.1 axi_vip_0
set_property -dict [list \
  CONFIG.ADDR_WIDTH 39 \
  CONFIG.ARUSER_WIDTH 0 \
  CONFIG.AWUSER_WIDTH 0 \
  CONFIG.BUSER_WIDTH 0 \
  CONFIG.DATA_WIDTH 512 \
  CONFIG.HAS_BRESP 1 \
  CONFIG.HAS_BURST 1 \
  CONFIG.HAS_CACHE 1 \
  CONFIG.HAS_LOCK 1 \
  CONFIG.HAS_PROT 1 \
  CONFIG.HAS_QOS 1 \
  CONFIG.HAS_REGION 1 \
  CONFIG.HAS_RRESP 1 \
  CONFIG.HAS_WSTRB 1 \
  CONFIG.ID_WIDTH 0 \
  CONFIG.INTERFACE_MODE MASTER \
  CONFIG.PROTOCOL AXI4 \
  CONFIG.READ_WRITE_MODE READ_WRITE \
  CONFIG.RUSER_BITS_PER_BYTE 0 \
  CONFIG.RUSER_WIDTH 0 \
  CONFIG.SUPPORTS_NARROW 1 \
  CONFIG.WUSER_BITS_PER_BYTE 0 \
  CONFIG.WUSER_WIDTH 0 \
] [get_bd_cells axi_vip_0]
create_bd_cell -type ip -vlnv xilinx.com:ip:axi_vip:1.1 axi_vip_0_p
set_property -dict [list \
  CONFIG.ADDR_WIDTH 39 \
  CONFIG.ARUSER_WIDTH 0 \
  CONFIG.AWUSER_WIDTH 0 \
  CONFIG.BUSER_WIDTH 0 \
  CONFIG.DATA_WIDTH 512 \
  CONFIG.HAS_BRESP 1 \
  CONFIG.HAS_BURST 1 \
  CONFIG.HAS_CACHE 1 \
  CONFIG.HAS_LOCK 1 \
  CONFIG.HAS_PROT 1 \
  CONFIG.HAS_QOS 1 \
  CONFIG.HAS_REGION 1 \
  CONFIG.HAS_RRESP 1 \
  CONFIG.HAS_WSTRB 1 \
  CONFIG.ID_WIDTH 0 \
  CONFIG.INTERFACE_MODE MASTER \
  CONFIG.PROTOCOL AXI4 \
  CONFIG.READ_WRITE_MODE READ_WRITE \
  CONFIG.RUSER_BITS_PER_BYTE 0 \
  CONFIG.RUSER_WIDTH 0 \
  CONFIG.SUPPORTS_NARROW 1 \
  CONFIG.WUSER_BITS_PER_BYTE 0 \
  CONFIG.WUSER_WIDTH 0 \
] [get_bd_cells axi_vip_0_p]
create_bd_cell -type ip -vlnv xilinx.com:ip:util_ds_buf:2.2 ddr1_clk_bufg
set_property -dict {CONFIG.C_BUF_TYPE BUFG} [get_bd_cells ddr1_clk_bufg]
create_bd_cell -type ip -vlnv xilinx.com:ip:util_ds_buf:2.2 ddr1_clk_ibufds
create_bd_cell -type ip -vlnv xilinx.com:ip:ddr4:2.2 ddrmem_1
set_property -dict [list \
  CONFIG.C0.BANK_GROUP_WIDTH 1 \
  CONFIG.C0.DDR4_AxiAddressWidth 32 \
  CONFIG.C0.DDR4_AxiDataWidth 512 \
  CONFIG.C0.DDR4_CasLatency 17 \
  CONFIG.C0.DDR4_CasWriteLatency 12 \
  CONFIG.C0.DDR4_DataMask NO_DM_NO_DBI \
  CONFIG.C0.DDR4_DataWidth 72 \
  CONFIG.C0.DDR4_InputClockPeriod 9996 \
  CONFIG.C0.DDR4_MemoryPart MT40A512M16HA-075E \
  CONFIG.C0.DDR4_TimePeriod 833 \
  CONFIG.C0.DDR4_isCustom false \
  CONFIG.System_Clock No_Buffer \
] [get_bd_cells ddrmem_1]
create_bd_cell -type ip -vlnv xilinx.com:ip:xlslice:1.0 xlslice_0
set_property -dict {CONFIG.DIN_WIDTH 2} [get_bd_cells xlslice_0]
create_bd_cell -type ip -vlnv xilinx.com:ip:xlslice:1.0 xlslice_1
set_property -dict {CONFIG.DIN_FROM 1 CONFIG.DIN_TO 1 CONFIG.DIN_WIDTH 2 CONFIG.DOUT_WIDTH 1} [get_bd_cells xlslice_1]
create_bd_cell -type ip -vlnv xilinx.com:ip:xlslice:1.0 xlslice_2
set_property -dict {CONFIG.DIN_WIDTH 3} [get_bd_cells xlslice_2]
create_bd_cell -type ip -vlnv xilinx.com:ip:xlslice:1.0 xlslice_3
set_property -dict {CONFIG.DIN_FROM 1 CONFIG.DIN_TO 1 CONFIG.DIN_WIDTH 3 CONFIG.DOUT_WIDTH 1} [get_bd_cells xlslice_3]
create_bd_cell -type ip -vlnv xilinx.com:ip:xlslice:1.0 xlslice_4
set_property -dict {CONFIG.DIN_FROM 2 CONFIG.DIN_TO 2 CONFIG.DIN_WIDTH 3 CONFIG.DOUT_WIDTH 1} [get_bd_cells xlslice_4]
create_bd_cell -type hier interrupt_concat
create_bd_cell -type ip -vlnv xilinx.com:ip:proc_sys_reset:5.0 psreset_ddrmem_n_1
set_property -dict {CONFIG.C_AUX_RST_WIDTH 1 CONFIG.C_EXT_RST_WIDTH 1} [get_bd_cells psreset_ddrmem_n_1]
create_bd_cell -type ip -vlnv xilinx.com:ip:axi_register_slice:2.1 regslice_periph_null
set_property -dict [list \
  CONFIG.ADDR_WIDTH 40 \
  CONFIG.DATA_WIDTH 64 \
  CONFIG.NUM_READ_OUTSTANDING 32 \
  CONFIG.NUM_WRITE_OUTSTANDING 32 \
  CONFIG.PROTOCOL AXI4 \
  CONFIG.READ_WRITE_MODE READ_WRITE \
  CONFIG.REG_AR 0 \
  CONFIG.REG_AW 0 \
  CONFIG.REG_B 0 \
  CONFIG.REG_R 0 \
  CONFIG.REG_W 0 \
  CONFIG.SUPPORTS_NARROW_BURST 1 \
] [get_bd_cells regslice_periph_null]
create_bd_cell -type ip -vlnv xilinx.com:ip:debug_bridge:3.0 user_debug_bridge
set_property -dict [list \
  CONFIG.C_BSCAN_MUX 1 \
  CONFIG.C_DEBUG_MODE 2 \
  CONFIG.C_NUM_BS_MASTER 1 \
  CONFIG.C_XVC_HW_ID 0x0001 \
] [get_bd_cells user_debug_bridge]
create_bd_cell -type ip -vlnv xilinx.com:ip:debug_bridge:3.0 debug_bridge_xsdbm
set_property -dict [list \
  CONFIG.C_DEBUG_MODE 1 \
  CONFIG.C_DESIGN_TYPE 1 \
  CONFIG.C_ENABLE_CLK_DIVIDER false \
] [get_bd_cells debug_bridge_xsdbm]
create_bd_cell -type ip -vlnv xilinx.com:ip:fpga_dna_module:1.0 fpga_dna_module_0
create_bd_cell -type ip -vlnv xilinx.com:ip:axi_protocol_converter:2.1 axi_protocol_convert_0
set_property -dict {CONFIG.DATA_WIDTH 32} [get_bd_cells axi_protocol_convert_0]
create_bd_cell -type hier slr1

# ---- hierarchy /interrupt_concat ----
current_bd_instance /interrupt_concat
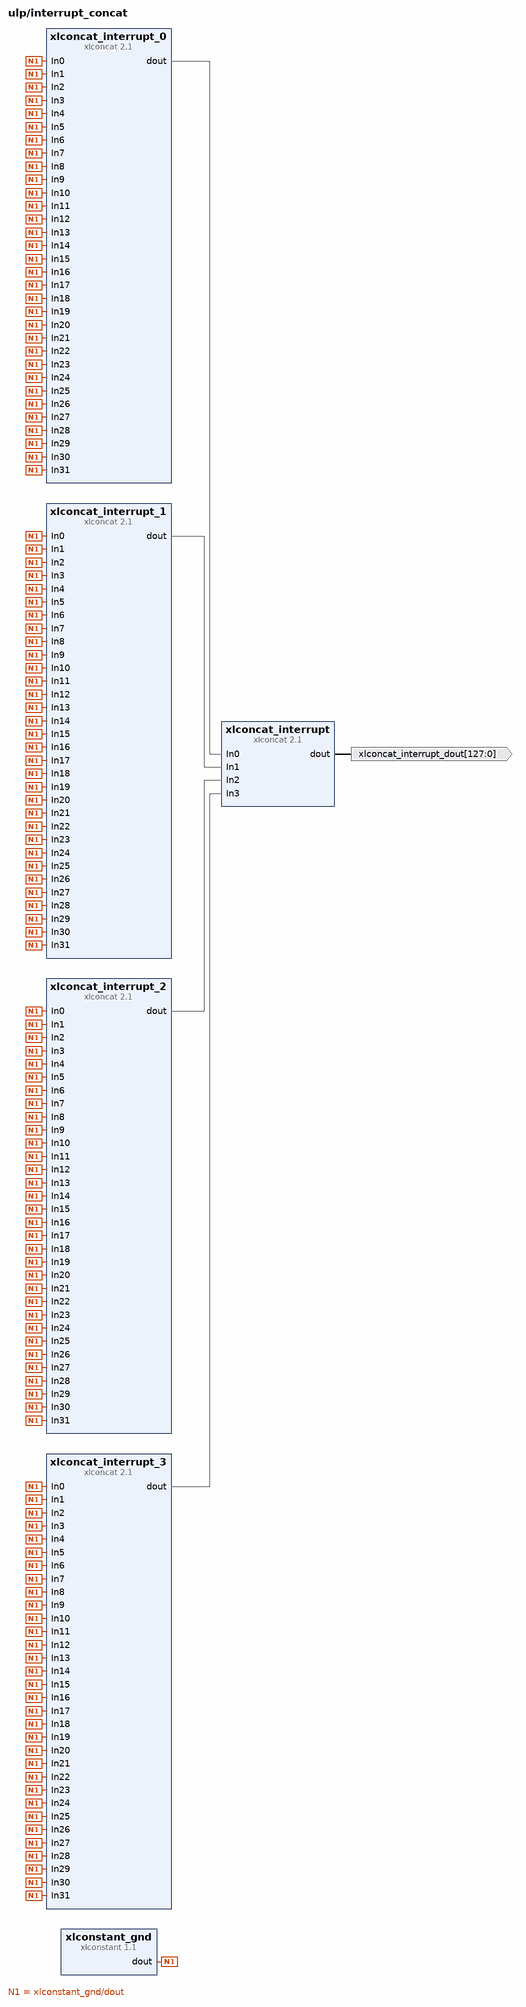
[diagram p5: block diagram inside /interrupt_concat]
create_bd_pin -dir O -from 127 -to 0 xlconcat_interrupt_dout

create_bd_cell -type ip -vlnv xilinx.com:ip:xlconcat:2.1 xlconcat_interrupt
set_property -dict {CONFIG.NUM_PORTS 4} [get_bd_cells xlconcat_interrupt]
create_bd_cell -type ip -vlnv xilinx.com:ip:xlconcat:2.1 xlconcat_interrupt_0
set_property -dict {CONFIG.NUM_PORTS 32} [get_bd_cells xlconcat_interrupt_0]
create_bd_cell -type ip -vlnv xilinx.com:ip:xlconcat:2.1 xlconcat_interrupt_1
set_property -dict {CONFIG.NUM_PORTS 32} [get_bd_cells xlconcat_interrupt_1]
create_bd_cell -type ip -vlnv xilinx.com:ip:xlconcat:2.1 xlconcat_interrupt_2
set_property -dict {CONFIG.NUM_PORTS 32} [get_bd_cells xlconcat_interrupt_2]
create_bd_cell -type ip -vlnv xilinx.com:ip:xlconcat:2.1 xlconcat_interrupt_3
set_property -dict {CONFIG.NUM_PORTS 32} [get_bd_cells xlconcat_interrupt_3]
create_bd_cell -type ip -vlnv xilinx.com:ip:xlconstant:1.1 xlconstant_gnd
set_property -dict {CONFIG.CONST_VAL 0} [get_bd_cells xlconstant_gnd]

# ---- hierarchy /slr1 ----
current_bd_instance /slr1
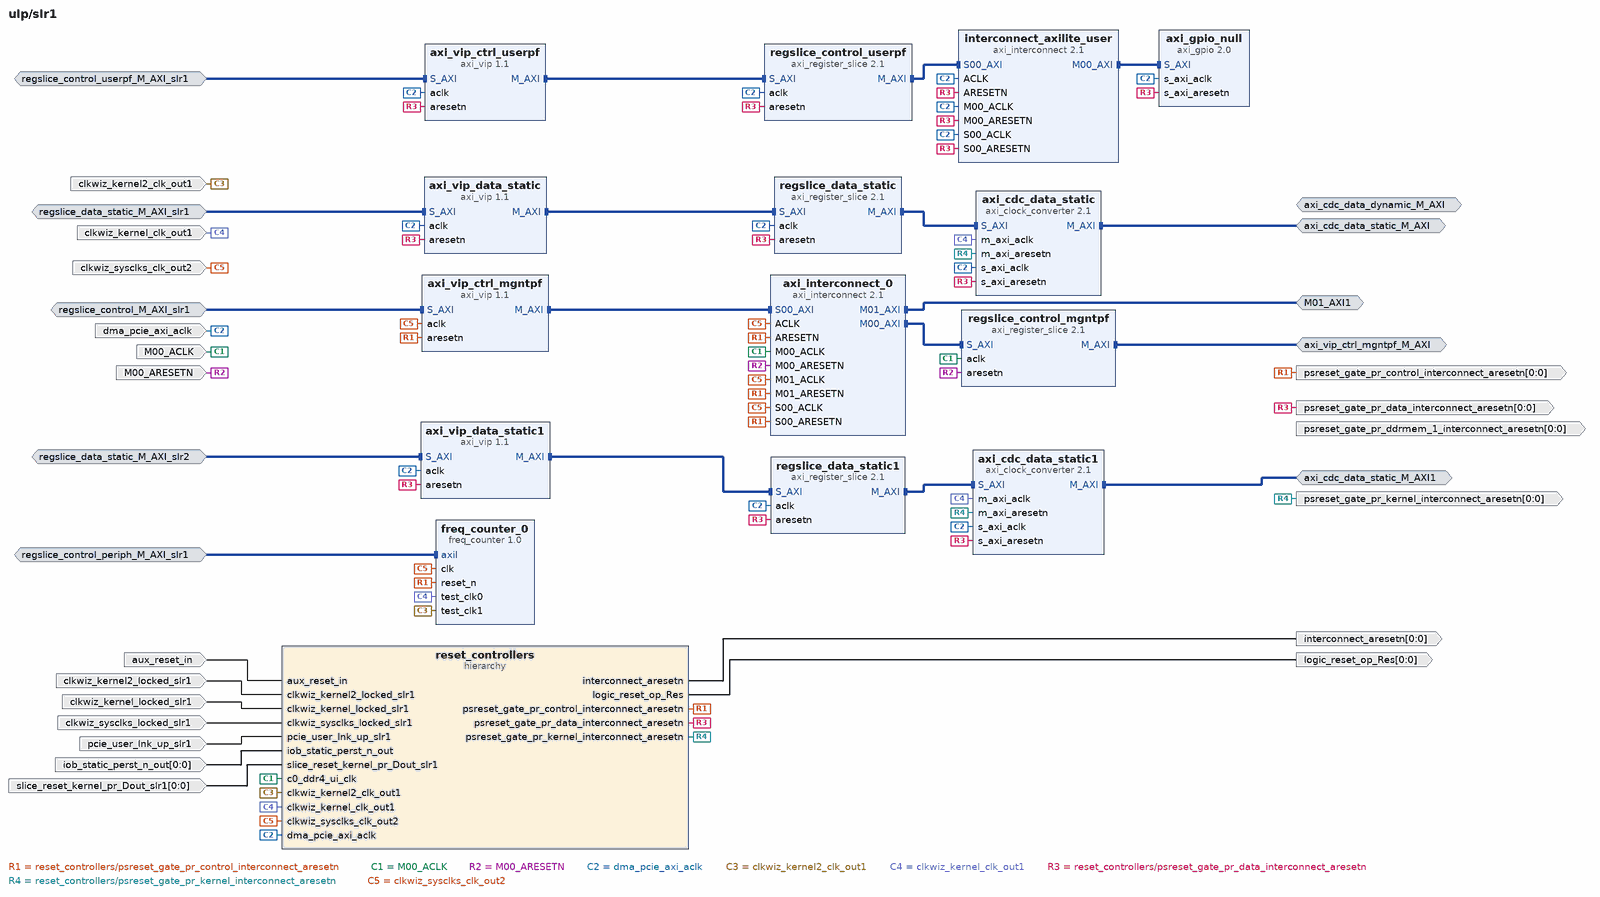
[diagram p6: block diagram inside /slr1]
create_bd_intf_pin -mode Master -vlnv xilinx.com:interface:aximm_rtl:1.0 M01_AXI1
create_bd_intf_pin -mode Master -vlnv xilinx.com:interface:aximm_rtl:1.0 axi_cdc_data_dynamic_M_AXI
create_bd_intf_pin -mode Master -vlnv xilinx.com:interface:aximm_rtl:1.0 axi_cdc_data_static_M_AXI
create_bd_intf_pin -mode Master -vlnv xilinx.com:interface:aximm_rtl:1.0 axi_cdc_data_static_M_AXI1
create_bd_intf_pin -mode Master -vlnv xilinx.com:interface:aximm_rtl:1.0 axi_vip_ctrl_mgntpf_M_AXI
create_bd_intf_pin -mode Slave -vlnv xilinx.com:interface:aximm_rtl:1.0 regslice_control_M_AXI_slr1
create_bd_intf_pin -mode Slave -vlnv xilinx.com:interface:aximm_rtl:1.0 regslice_control_periph_M_AXI_slr1
create_bd_intf_pin -mode Slave -vlnv xilinx.com:interface:aximm_rtl:1.0 regslice_control_userpf_M_AXI_slr1
create_bd_intf_pin -mode Slave -vlnv xilinx.com:interface:aximm_rtl:1.0 regslice_data_static_M_AXI_slr1
create_bd_intf_pin -mode Slave -vlnv xilinx.com:interface:aximm_rtl:1.0 regslice_data_static_M_AXI_slr2
create_bd_pin -dir I -type clk M00_ACLK
create_bd_pin -dir I -type rst M00_ARESETN
create_bd_pin -dir I -type rst aux_reset_in
create_bd_pin -dir I -type clk clkwiz_kernel2_clk_out1
create_bd_pin -dir I clkwiz_kernel2_locked_slr1
create_bd_pin -dir I -type clk clkwiz_kernel_clk_out1
create_bd_pin -dir I clkwiz_kernel_locked_slr1
create_bd_pin -dir I -type clk clkwiz_sysclks_clk_out2
create_bd_pin -dir I clkwiz_sysclks_locked_slr1
create_bd_pin -dir I -type clk dma_pcie_axi_aclk
create_bd_pin -dir O -from 0 -to 0 -type rst interconnect_aresetn
create_bd_pin -dir I -from 0 -to 0 iob_static_perst_n_out
create_bd_pin -dir O -from 0 -to 0 logic_reset_op_Res
create_bd_pin -dir I pcie_user_lnk_up_slr1
create_bd_pin -dir O -from 0 -to 0 -type rst psreset_gate_pr_control_interconnect_aresetn
create_bd_pin -dir O -from 0 -to 0 -type rst psreset_gate_pr_data_interconnect_aresetn
create_bd_pin -dir O -from 0 -to 0 -type rst psreset_gate_pr_ddrmem_1_interconnect_aresetn
create_bd_pin -dir O -from 0 -to 0 -type rst psreset_gate_pr_kernel_interconnect_aresetn
create_bd_pin -dir I -from 0 -to 0 -type rst slice_reset_kernel_pr_Dout_slr1

create_bd_cell -type ip -vlnv xilinx.com:ip:axi_clock_converter:2.1 axi_cdc_data_static
create_bd_cell -type ip -vlnv xilinx.com:ip:axi_clock_converter:2.1 axi_cdc_data_static1
create_bd_cell -type ip -vlnv xilinx.com:ip:axi_gpio:2.0 axi_gpio_null
create_bd_cell -type ip -vlnv xilinx.com:ip:axi_interconnect:2.1 axi_interconnect_0
set_property -dict {CONFIG.NUM_MI 2} [get_bd_cells axi_interconnect_0]
create_bd_cell -type ip -vlnv xilinx.com:ip:axi_vip:1.1 axi_vip_ctrl_mgntpf
create_bd_cell -type ip -vlnv xilinx.com:ip:axi_vip:1.1 axi_vip_ctrl_userpf
create_bd_cell -type ip -vlnv xilinx.com:ip:axi_vip:1.1 axi_vip_data_static
create_bd_cell -type ip -vlnv xilinx.com:ip:axi_vip:1.1 axi_vip_data_static1
create_bd_cell -type ip -vlnv xilinx.com:user:freq_counter:1.0 freq_counter_0
set_property -dict {CONFIG.REF_CLK_FREQ_HZ 50925} [get_bd_cells freq_counter_0]
create_bd_cell -type ip -vlnv xilinx.com:ip:axi_interconnect:2.1 interconnect_axilite_user
set_property -dict [list \
  CONFIG.M00_HAS_REGSLICE 4 \
  CONFIG.M01_HAS_REGSLICE 4 \
  CONFIG.M02_HAS_REGSLICE 4 \
  CONFIG.M03_HAS_REGSLICE 4 \
  CONFIG.M04_HAS_REGSLICE 4 \
  CONFIG.M05_HAS_REGSLICE 4 \
  CONFIG.M06_HAS_REGSLICE 4 \
  CONFIG.M07_HAS_REGSLICE 4 \
  CONFIG.M08_HAS_REGSLICE 4 \
  CONFIG.M09_HAS_REGSLICE 4 \
  CONFIG.M10_HAS_REGSLICE 4 \
  CONFIG.M11_HAS_REGSLICE 4 \
  CONFIG.M12_HAS_REGSLICE 4 \
  CONFIG.M13_HAS_REGSLICE 4 \
  CONFIG.M14_HAS_REGSLICE 4 \
  CONFIG.M15_HAS_REGSLICE 4 \
  CONFIG.M16_HAS_REGSLICE 4 \
  CONFIG.M17_HAS_REGSLICE 4 \
  CONFIG.M18_HAS_REGSLICE 4 \
  CONFIG.M19_HAS_REGSLICE 4 \
  CONFIG.M20_HAS_REGSLICE 4 \
  CONFIG.M21_HAS_REGSLICE 4 \
  CONFIG.M22_HAS_REGSLICE 4 \
  CONFIG.M23_HAS_REGSLICE 4 \
  CONFIG.M24_HAS_REGSLICE 4 \
  CONFIG.M25_HAS_REGSLICE 4 \
  CONFIG.M26_HAS_REGSLICE 4 \
  CONFIG.M27_HAS_REGSLICE 4 \
  CONFIG.M28_HAS_REGSLICE 4 \
  CONFIG.M29_HAS_REGSLICE 4 \
  CONFIG.M30_HAS_REGSLICE 4 \
  CONFIG.M31_HAS_REGSLICE 4 \
  CONFIG.M32_HAS_REGSLICE 4 \
  CONFIG.M33_HAS_REGSLICE 4 \
  CONFIG.M34_HAS_REGSLICE 4 \
  CONFIG.M35_HAS_REGSLICE 4 \
  CONFIG.M36_HAS_REGSLICE 4 \
  CONFIG.M37_HAS_REGSLICE 4 \
  CONFIG.M38_HAS_REGSLICE 4 \
  CONFIG.M39_HAS_REGSLICE 4 \
  CONFIG.M40_HAS_REGSLICE 4 \
  CONFIG.M41_HAS_REGSLICE 4 \
  CONFIG.M42_HAS_REGSLICE 4 \
  CONFIG.M43_HAS_REGSLICE 4 \
  CONFIG.M44_HAS_REGSLICE 4 \
  CONFIG.M45_HAS_REGSLICE 4 \
  CONFIG.M46_HAS_REGSLICE 4 \
  CONFIG.M47_HAS_REGSLICE 4 \
  CONFIG.M48_HAS_REGSLICE 4 \
  CONFIG.M49_HAS_REGSLICE 4 \
  CONFIG.M50_HAS_REGSLICE 4 \
  CONFIG.M51_HAS_REGSLICE 4 \
  CONFIG.M52_HAS_REGSLICE 4 \
  CONFIG.M53_HAS_REGSLICE 4 \
  CONFIG.M54_HAS_REGSLICE 4 \
  CONFIG.M55_HAS_REGSLICE 4 \
  CONFIG.M56_HAS_REGSLICE 4 \
  CONFIG.M57_HAS_REGSLICE 4 \
  CONFIG.M58_HAS_REGSLICE 4 \
  CONFIG.M59_HAS_REGSLICE 4 \
  CONFIG.M60_HAS_REGSLICE 4 \
  CONFIG.M61_HAS_REGSLICE 4 \
  CONFIG.M62_HAS_REGSLICE 4 \
  CONFIG.M63_HAS_REGSLICE 4 \
  CONFIG.NUM_MI 1 \
  CONFIG.S00_HAS_REGSLICE 4 \
] [get_bd_cells interconnect_axilite_user]
create_bd_cell -type ip -vlnv xilinx.com:ip:axi_register_slice:2.1 regslice_control_mgntpf
set_property -dict [list \
  CONFIG.ADDR_WIDTH 26 \
  CONFIG.DATA_WIDTH 32 \
  CONFIG.PROTOCOL AXI4LITE \
  CONFIG.READ_WRITE_MODE READ_WRITE \
] [get_bd_cells regslice_control_mgntpf]
create_bd_cell -type ip -vlnv xilinx.com:ip:axi_register_slice:2.1 regslice_control_userpf
set_property -dict [list \
  CONFIG.ADDR_WIDTH 25 \
  CONFIG.DATA_WIDTH 32 \
  CONFIG.PROTOCOL AXI4LITE \
  CONFIG.READ_WRITE_MODE READ_WRITE \
] [get_bd_cells regslice_control_userpf]
create_bd_cell -type ip -vlnv xilinx.com:ip:axi_register_slice:2.1 regslice_data_static
set_property -dict [list \
  CONFIG.ADDR_WIDTH 39 \
  CONFIG.DATA_WIDTH 512 \
  CONFIG.ID_WIDTH 4 \
  CONFIG.PROTOCOL AXI4 \
  CONFIG.READ_WRITE_MODE READ_WRITE \
  CONFIG.REG_AR 1 \
  CONFIG.REG_AW 1 \
  CONFIG.REG_B 1 \
  CONFIG.REG_W 1 \
] [get_bd_cells regslice_data_static]
create_bd_cell -type ip -vlnv xilinx.com:ip:axi_register_slice:2.1 regslice_data_static1
set_property -dict [list \
  CONFIG.ADDR_WIDTH 39 \
  CONFIG.DATA_WIDTH 128 \
  CONFIG.ID_WIDTH 4 \
  CONFIG.PROTOCOL AXI4 \
  CONFIG.READ_WRITE_MODE READ_WRITE \
  CONFIG.REG_AR 1 \
  CONFIG.REG_AW 1 \
  CONFIG.REG_B 1 \
  CONFIG.REG_W 1 \
] [get_bd_cells regslice_data_static1]
create_bd_cell -type hier reset_controllers

# ---- hierarchy /slr1/reset_controllers ----
current_bd_instance /slr1/reset_controllers
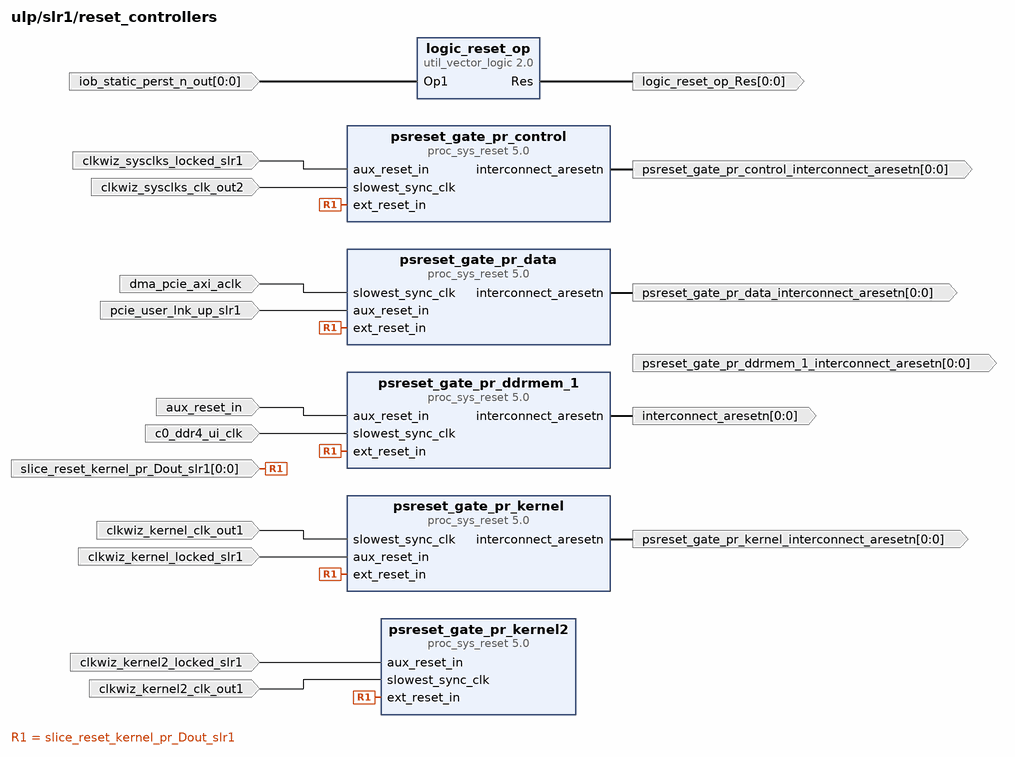
[diagram p7: block diagram inside /slr1/reset_controllers]
create_bd_pin -dir I -type rst aux_reset_in
create_bd_pin -dir I -type clk c0_ddr4_ui_clk
create_bd_pin -dir I -type clk clkwiz_kernel2_clk_out1
create_bd_pin -dir I clkwiz_kernel2_locked_slr1
create_bd_pin -dir I -type clk clkwiz_kernel_clk_out1
create_bd_pin -dir I clkwiz_kernel_locked_slr1
create_bd_pin -dir I -type clk clkwiz_sysclks_clk_out2
create_bd_pin -dir I clkwiz_sysclks_locked_slr1
create_bd_pin -dir I -type clk dma_pcie_axi_aclk
create_bd_pin -dir O -from 0 -to 0 -type rst interconnect_aresetn
create_bd_pin -dir I -from 0 -to 0 iob_static_perst_n_out
create_bd_pin -dir O -from 0 -to 0 logic_reset_op_Res
create_bd_pin -dir I pcie_user_lnk_up_slr1
create_bd_pin -dir O -from 0 -to 0 -type rst psreset_gate_pr_control_interconnect_aresetn
create_bd_pin -dir O -from 0 -to 0 -type rst psreset_gate_pr_data_interconnect_aresetn
create_bd_pin -dir O -from 0 -to 0 -type rst psreset_gate_pr_ddrmem_1_interconnect_aresetn
create_bd_pin -dir O -from 0 -to 0 -type rst psreset_gate_pr_kernel_interconnect_aresetn
create_bd_pin -dir I -from 0 -to 0 -type rst slice_reset_kernel_pr_Dout_slr1

create_bd_cell -type ip -vlnv xilinx.com:ip:util_vector_logic:2.0 logic_reset_op
set_property -dict {CONFIG.C_OPERATION not CONFIG.C_SIZE 1} [get_bd_cells logic_reset_op]
create_bd_cell -type ip -vlnv xilinx.com:ip:proc_sys_reset:5.0 psreset_gate_pr_control
set_property -dict [list \
  CONFIG.C_AUX_RESET_HIGH 0 \
  CONFIG.C_AUX_RST_WIDTH 1 \
  CONFIG.C_EXT_RST_WIDTH 1 \
] [get_bd_cells psreset_gate_pr_control]
create_bd_cell -type ip -vlnv xilinx.com:ip:proc_sys_reset:5.0 psreset_gate_pr_data
set_property -dict [list \
  CONFIG.C_AUX_RESET_HIGH 0 \
  CONFIG.C_AUX_RST_WIDTH 1 \
  CONFIG.C_EXT_RST_WIDTH 1 \
] [get_bd_cells psreset_gate_pr_data]
create_bd_cell -type ip -vlnv xilinx.com:ip:proc_sys_reset:5.0 psreset_gate_pr_ddrmem_1
set_property -dict [list \
  CONFIG.C_AUX_RESET_HIGH 0 \
  CONFIG.C_AUX_RST_WIDTH 1 \
  CONFIG.C_EXT_RST_WIDTH 1 \
] [get_bd_cells psreset_gate_pr_ddrmem_1]
create_bd_cell -type ip -vlnv xilinx.com:ip:proc_sys_reset:5.0 psreset_gate_pr_kernel
set_property -dict [list \
  CONFIG.C_AUX_RESET_HIGH 0 \
  CONFIG.C_AUX_RST_WIDTH 1 \
  CONFIG.C_EXT_RST_WIDTH 1 \
] [get_bd_cells psreset_gate_pr_kernel]
create_bd_cell -type ip -vlnv xilinx.com:ip:proc_sys_reset:5.0 psreset_gate_pr_kernel2
set_property -dict [list \
  CONFIG.C_AUX_RESET_HIGH 0 \
  CONFIG.C_AUX_RST_WIDTH 1 \
  CONFIG.C_EXT_RST_WIDTH 1 \
] [get_bd_cells psreset_gate_pr_kernel2]

# ---- connections ----

current_bd_instance /interrupt_concat
connect_bd_net [get_bd_pins xlconcat_interrupt_0/dout] [get_bd_pins xlconcat_interrupt/In0]
connect_bd_net [get_bd_pins xlconcat_interrupt_1/dout] [get_bd_pins xlconcat_interrupt/In1]
connect_bd_net [get_bd_pins xlconcat_interrupt_2/dout] [get_bd_pins xlconcat_interrupt/In2]
connect_bd_net [get_bd_pins xlconcat_interrupt_3/dout] [get_bd_pins xlconcat_interrupt/In3]
connect_bd_net [get_bd_pins xlconcat_interrupt/dout] [get_bd_pins xlconcat_interrupt_dout]
connect_bd_net [get_bd_pins xlconstant_gnd/dout] \
  [get_bd_pins xlconcat_interrupt_0/In0] [get_bd_pins xlconcat_interrupt_0/In1] [get_bd_pins xlconcat_interrupt_0/In2] \
  [get_bd_pins xlconcat_interrupt_0/In3] [get_bd_pins xlconcat_interrupt_0/In4] [get_bd_pins xlconcat_interrupt_0/In5] \
  [get_bd_pins xlconcat_interrupt_0/In6] [get_bd_pins xlconcat_interrupt_0/In7] [get_bd_pins xlconcat_interrupt_0/In8] \
  [get_bd_pins xlconcat_interrupt_0/In9] [get_bd_pins xlconcat_interrupt_0/In10] [get_bd_pins xlconcat_interrupt_0/In11] \
  [get_bd_pins xlconcat_interrupt_0/In12] [get_bd_pins xlconcat_interrupt_0/In13] [get_bd_pins xlconcat_interrupt_0/In14] \
  [get_bd_pins xlconcat_interrupt_0/In15] [get_bd_pins xlconcat_interrupt_0/In16] [get_bd_pins xlconcat_interrupt_0/In17] \
  [get_bd_pins xlconcat_interrupt_0/In18] [get_bd_pins xlconcat_interrupt_0/In19] [get_bd_pins xlconcat_interrupt_0/In20] \
  [get_bd_pins xlconcat_interrupt_0/In21] [get_bd_pins xlconcat_interrupt_0/In22] [get_bd_pins xlconcat_interrupt_0/In23] \
  [get_bd_pins xlconcat_interrupt_0/In24] [get_bd_pins xlconcat_interrupt_0/In25] [get_bd_pins xlconcat_interrupt_0/In26] \
  [get_bd_pins xlconcat_interrupt_0/In27] [get_bd_pins xlconcat_interrupt_0/In28] [get_bd_pins xlconcat_interrupt_0/In29] \
  [get_bd_pins xlconcat_interrupt_0/In30] [get_bd_pins xlconcat_interrupt_0/In31] [get_bd_pins xlconcat_interrupt_1/In0] \
  [get_bd_pins xlconcat_interrupt_1/In1] [get_bd_pins xlconcat_interrupt_1/In2] [get_bd_pins xlconcat_interrupt_1/In3] \
  [get_bd_pins xlconcat_interrupt_1/In4] [get_bd_pins xlconcat_interrupt_1/In5] [get_bd_pins xlconcat_interrupt_1/In6] \
  [get_bd_pins xlconcat_interrupt_1/In7] [get_bd_pins xlconcat_interrupt_1/In8] [get_bd_pins xlconcat_interrupt_1/In9] \
  [get_bd_pins xlconcat_interrupt_1/In10] [get_bd_pins xlconcat_interrupt_1/In11] [get_bd_pins xlconcat_interrupt_1/In12] \
  [get_bd_pins xlconcat_interrupt_1/In13] [get_bd_pins xlconcat_interrupt_1/In14] [get_bd_pins xlconcat_interrupt_1/In15] \
  [get_bd_pins xlconcat_interrupt_1/In16] [get_bd_pins xlconcat_interrupt_1/In17] [get_bd_pins xlconcat_interrupt_1/In18] \
  [get_bd_pins xlconcat_interrupt_1/In19] [get_bd_pins xlconcat_interrupt_1/In20] [get_bd_pins xlconcat_interrupt_1/In21] \
  [get_bd_pins xlconcat_interrupt_1/In22] [get_bd_pins xlconcat_interrupt_1/In23] [get_bd_pins xlconcat_interrupt_1/In24] \
  [get_bd_pins xlconcat_interrupt_1/In25] [get_bd_pins xlconcat_interrupt_1/In26] [get_bd_pins xlconcat_interrupt_1/In27] \
  [get_bd_pins xlconcat_interrupt_1/In28] [get_bd_pins xlconcat_interrupt_1/In29] [get_bd_pins xlconcat_interrupt_1/In30] \
  [get_bd_pins xlconcat_interrupt_1/In31] [get_bd_pins xlconcat_interrupt_2/In0] [get_bd_pins xlconcat_interrupt_2/In1] \
  [get_bd_pins xlconcat_interrupt_2/In2] [get_bd_pins xlconcat_interrupt_2/In3] [get_bd_pins xlconcat_interrupt_2/In4] \
  [get_bd_pins xlconcat_interrupt_2/In5] [get_bd_pins xlconcat_interrupt_2/In6] [get_bd_pins xlconcat_interrupt_2/In7] \
  [get_bd_pins xlconcat_interrupt_2/In8] [get_bd_pins xlconcat_interrupt_2/In9] [get_bd_pins xlconcat_interrupt_2/In10] \
  [get_bd_pins xlconcat_interrupt_2/In11] [get_bd_pins xlconcat_interrupt_2/In12] [get_bd_pins xlconcat_interrupt_2/In13] \
  [get_bd_pins xlconcat_interrupt_2/In14] [get_bd_pins xlconcat_interrupt_2/In15] [get_bd_pins xlconcat_interrupt_2/In16] \
  [get_bd_pins xlconcat_interrupt_2/In17] [get_bd_pins xlconcat_interrupt_2/In18] [get_bd_pins xlconcat_interrupt_2/In19] \
  [get_bd_pins xlconcat_interrupt_2/In20] [get_bd_pins xlconcat_interrupt_2/In21] [get_bd_pins xlconcat_interrupt_2/In22] \
  [get_bd_pins xlconcat_interrupt_2/In23] [get_bd_pins xlconcat_interrupt_2/In24] [get_bd_pins xlconcat_interrupt_2/In25] \
  [get_bd_pins xlconcat_interrupt_2/In26] [get_bd_pins xlconcat_interrupt_2/In27] [get_bd_pins xlconcat_interrupt_2/In28] \
  [get_bd_pins xlconcat_interrupt_2/In29] [get_bd_pins xlconcat_interrupt_2/In30] [get_bd_pins xlconcat_interrupt_2/In31] \
  [get_bd_pins xlconcat_interrupt_3/In0] [get_bd_pins xlconcat_interrupt_3/In1] [get_bd_pins xlconcat_interrupt_3/In2] \
  [get_bd_pins xlconcat_interrupt_3/In3] [get_bd_pins xlconcat_interrupt_3/In4] [get_bd_pins xlconcat_interrupt_3/In5] \
  [get_bd_pins xlconcat_interrupt_3/In6] [get_bd_pins xlconcat_interrupt_3/In7] [get_bd_pins xlconcat_interrupt_3/In8] \
  [get_bd_pins xlconcat_interrupt_3/In9] [get_bd_pins xlconcat_interrupt_3/In10] [get_bd_pins xlconcat_interrupt_3/In11] \
  [get_bd_pins xlconcat_interrupt_3/In12] [get_bd_pins xlconcat_interrupt_3/In13] [get_bd_pins xlconcat_interrupt_3/In14] \
  [get_bd_pins xlconcat_interrupt_3/In15] [get_bd_pins xlconcat_interrupt_3/In16] [get_bd_pins xlconcat_interrupt_3/In17] \
  [get_bd_pins xlconcat_interrupt_3/In18] [get_bd_pins xlconcat_interrupt_3/In19] [get_bd_pins xlconcat_interrupt_3/In20] \
  [get_bd_pins xlconcat_interrupt_3/In21] [get_bd_pins xlconcat_interrupt_3/In22] [get_bd_pins xlconcat_interrupt_3/In23] \
  [get_bd_pins xlconcat_interrupt_3/In24] [get_bd_pins xlconcat_interrupt_3/In25] [get_bd_pins xlconcat_interrupt_3/In26] \
  [get_bd_pins xlconcat_interrupt_3/In27] [get_bd_pins xlconcat_interrupt_3/In28] [get_bd_pins xlconcat_interrupt_3/In29] \
  [get_bd_pins xlconcat_interrupt_3/In30] [get_bd_pins xlconcat_interrupt_3/In31]
